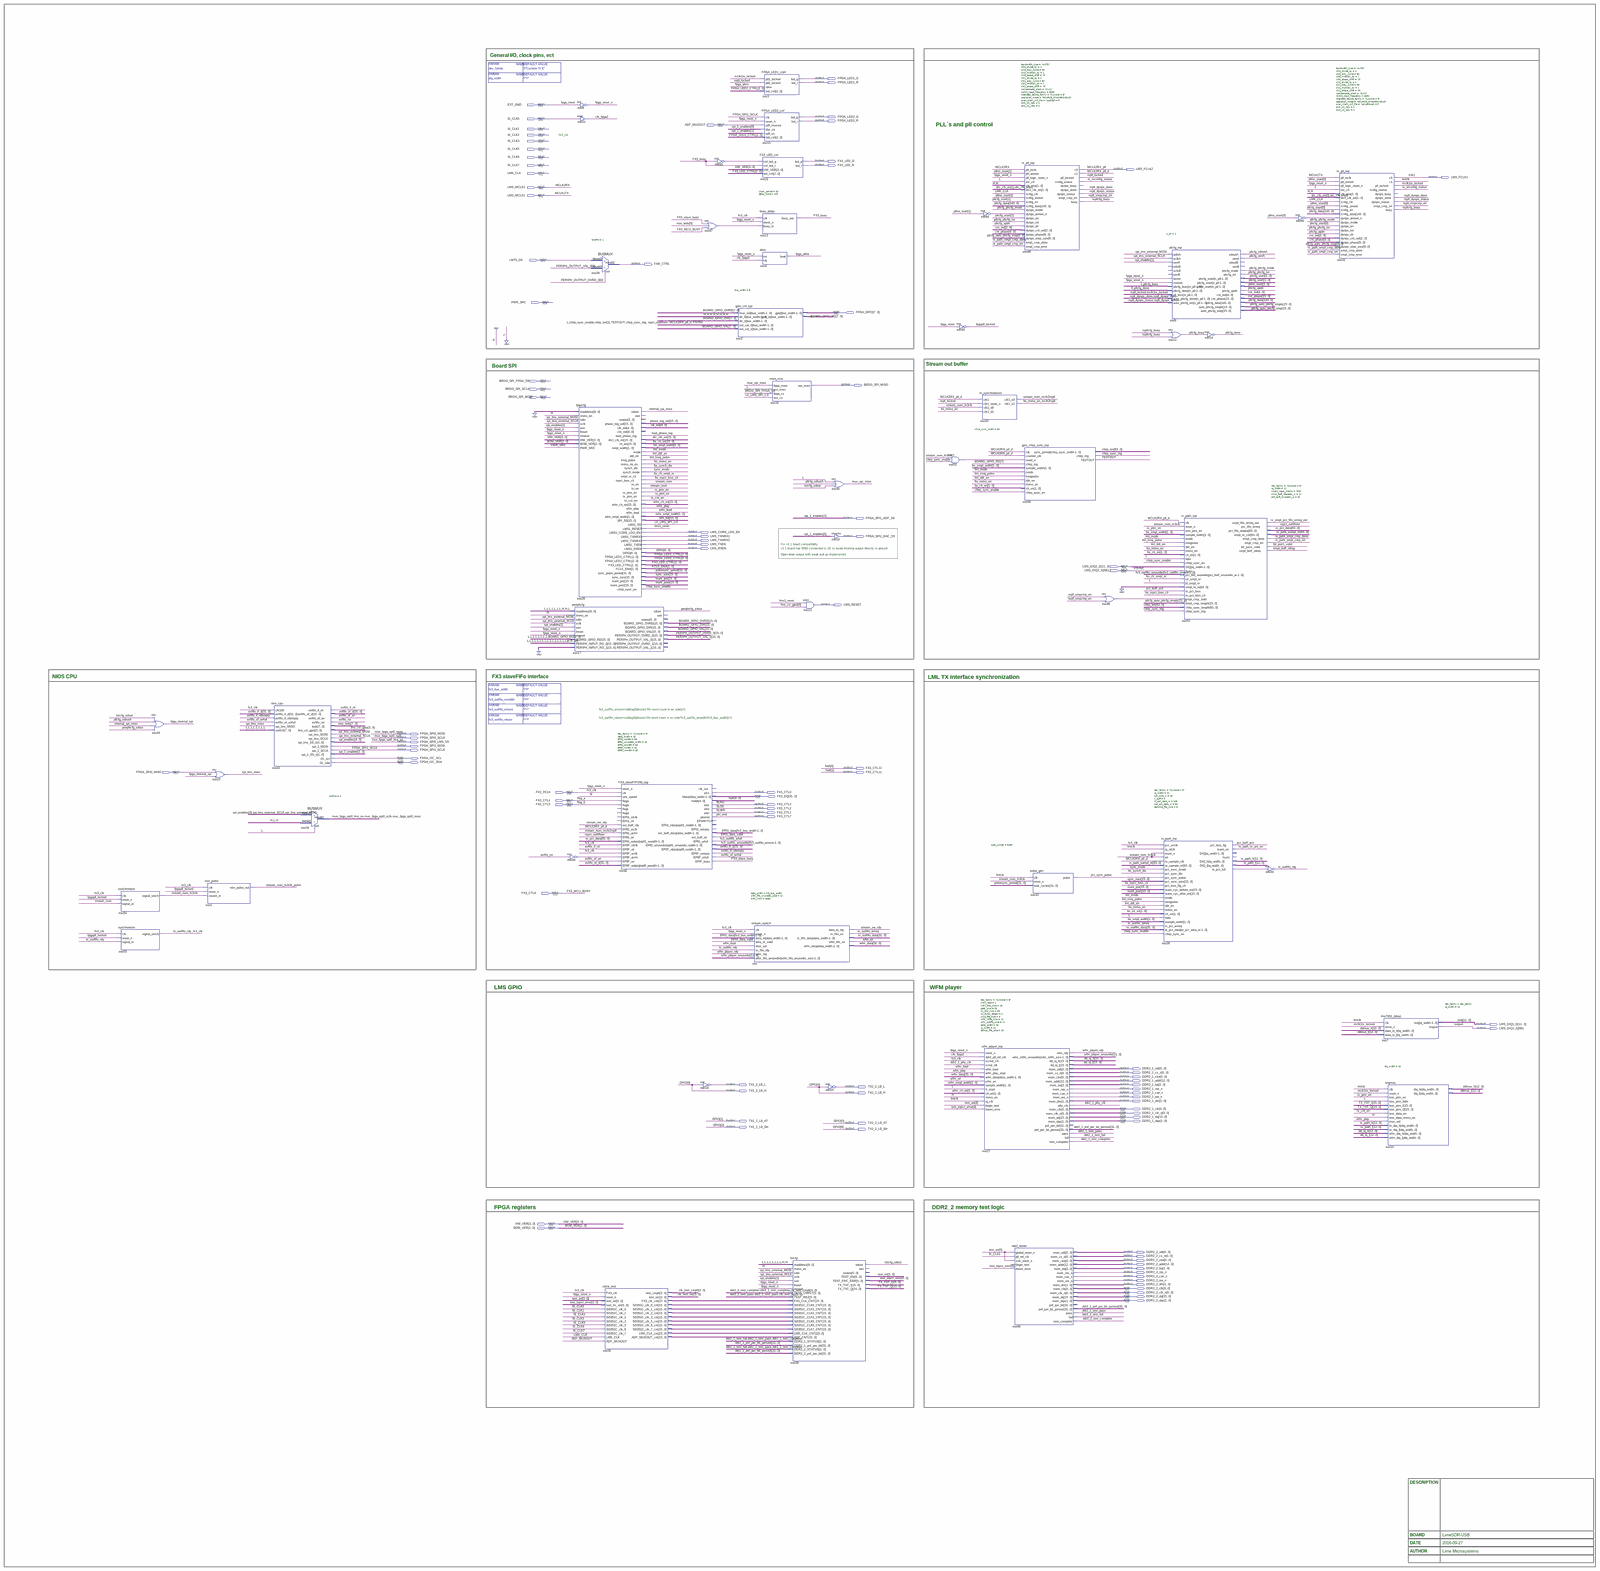
[diagram p0: schematic sheet, whole]
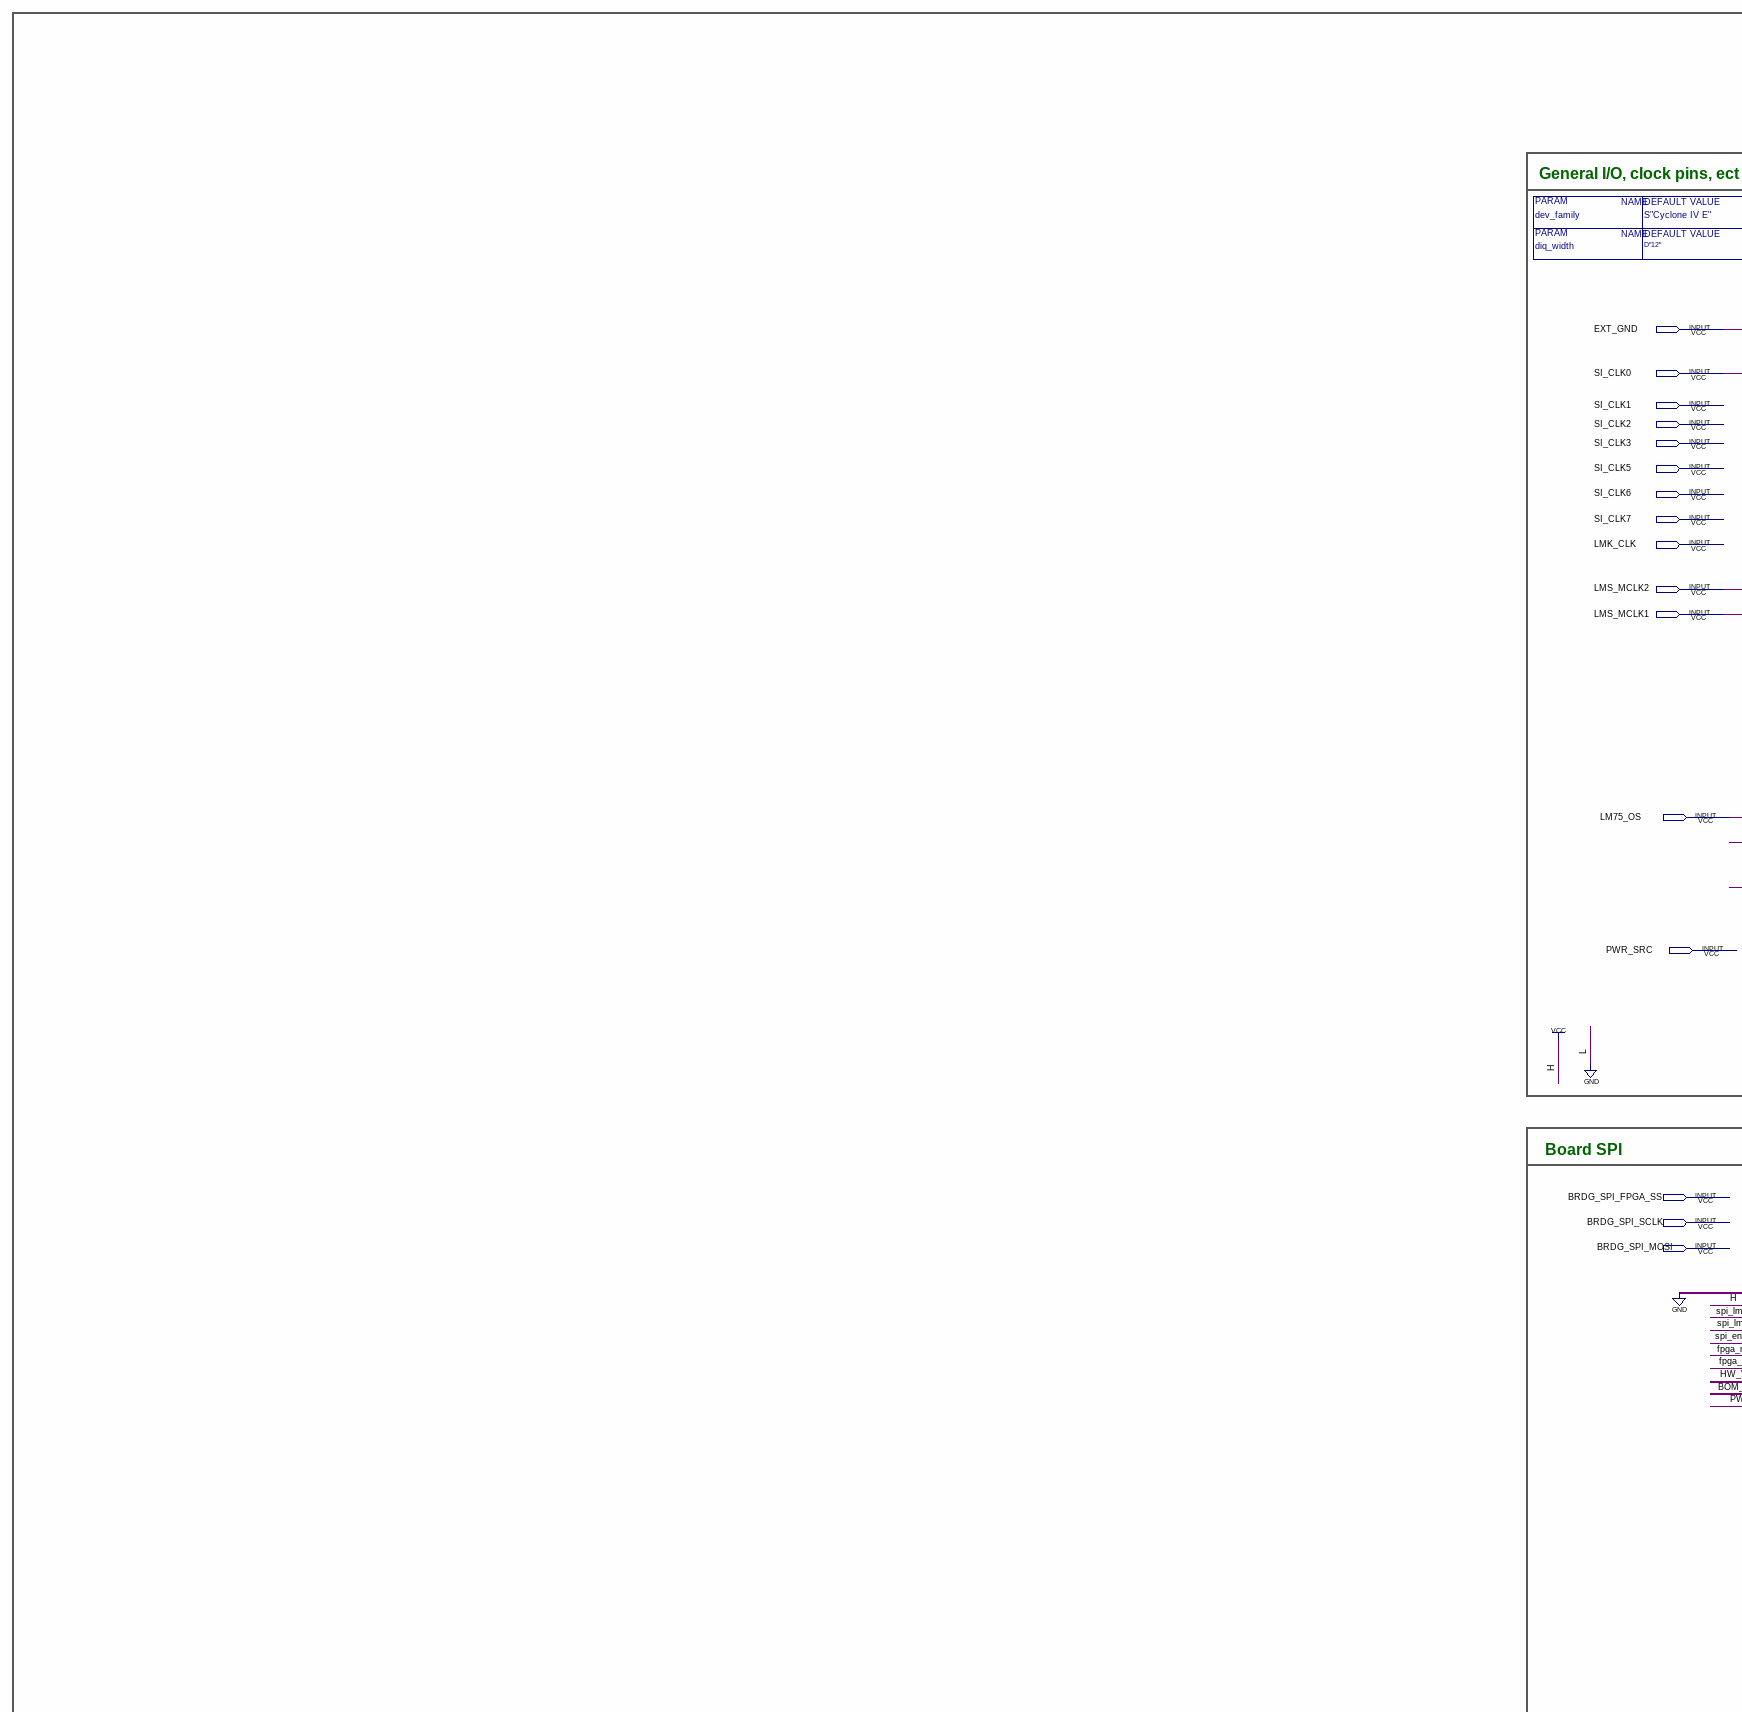
[diagram p1: schematic sheet, upper left part]
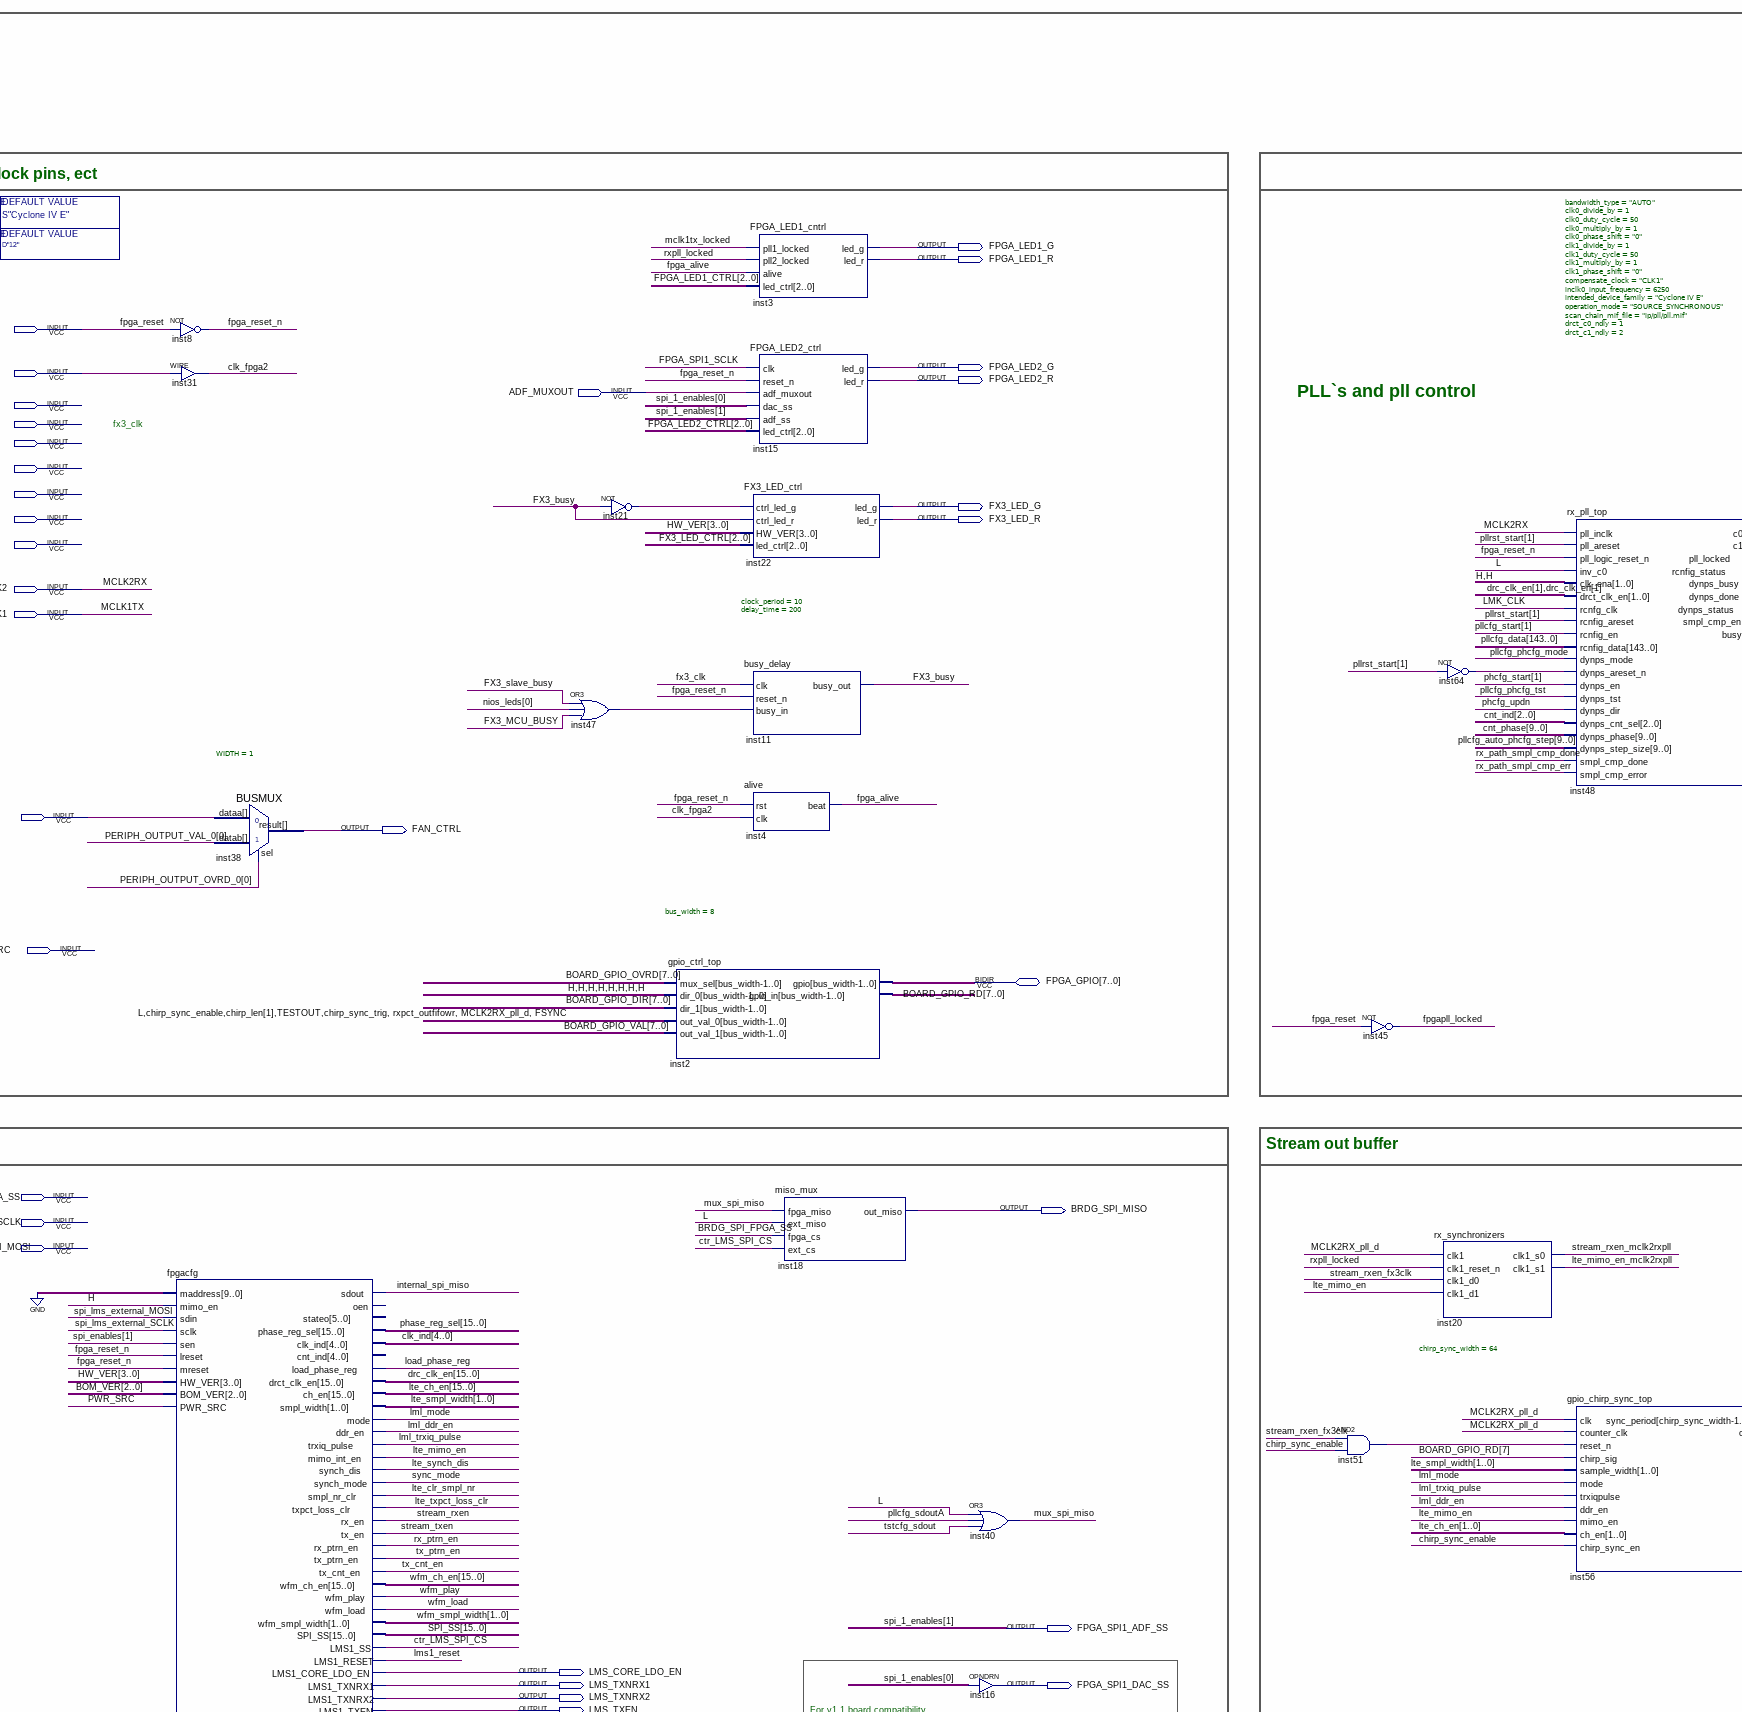
[diagram p2: schematic sheet, upper centre part]
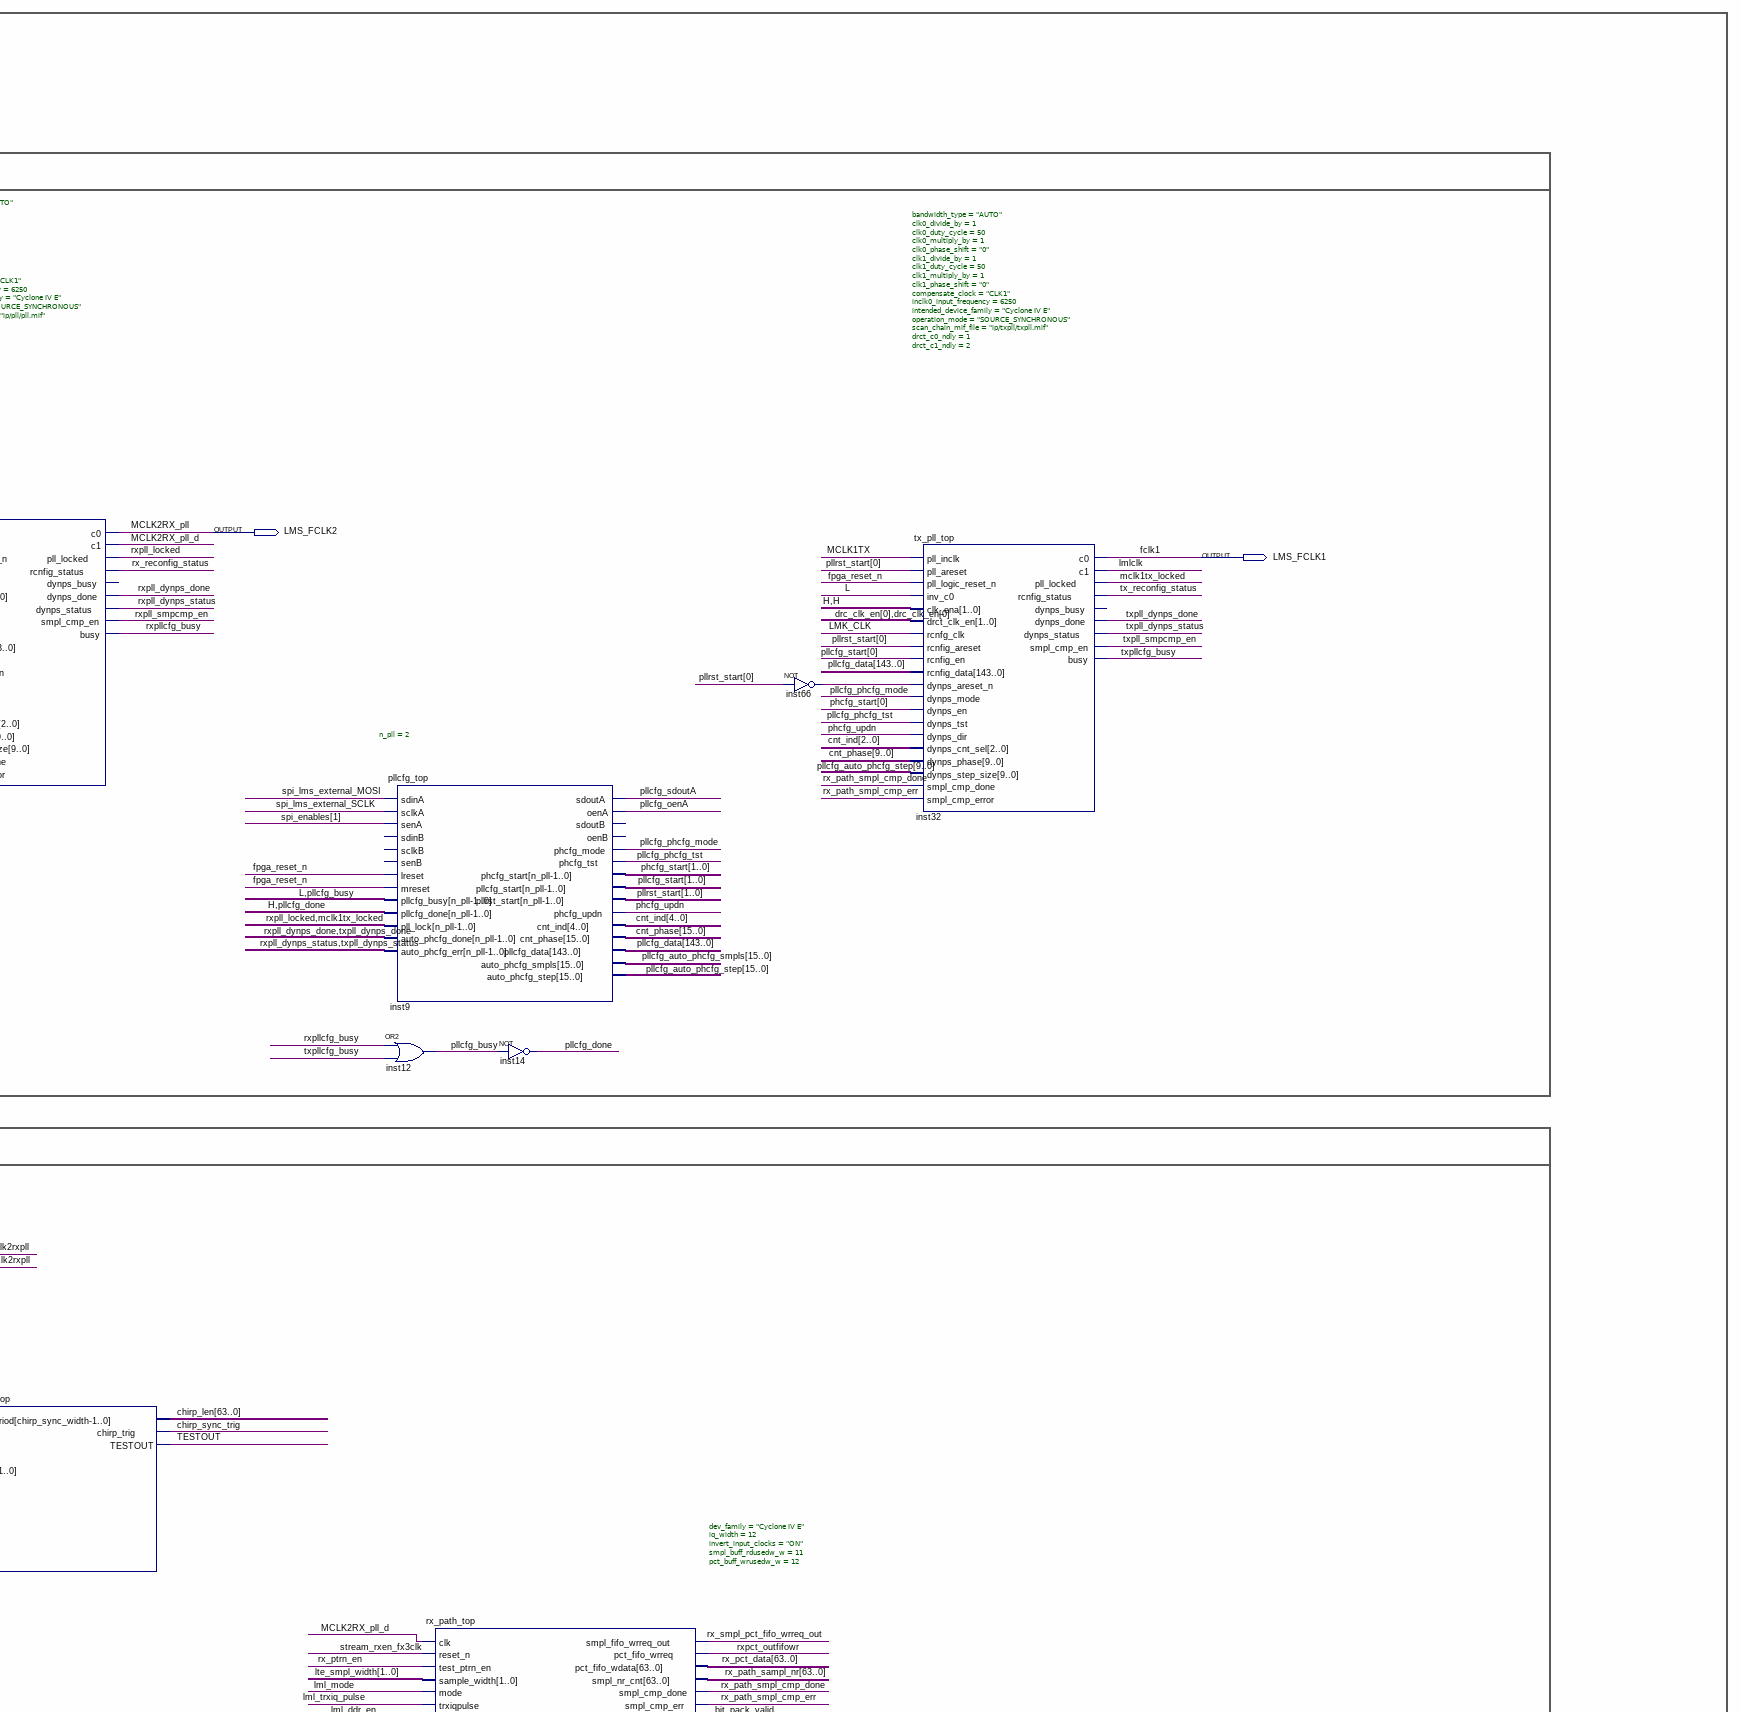
[diagram p3: schematic sheet, upper right part]
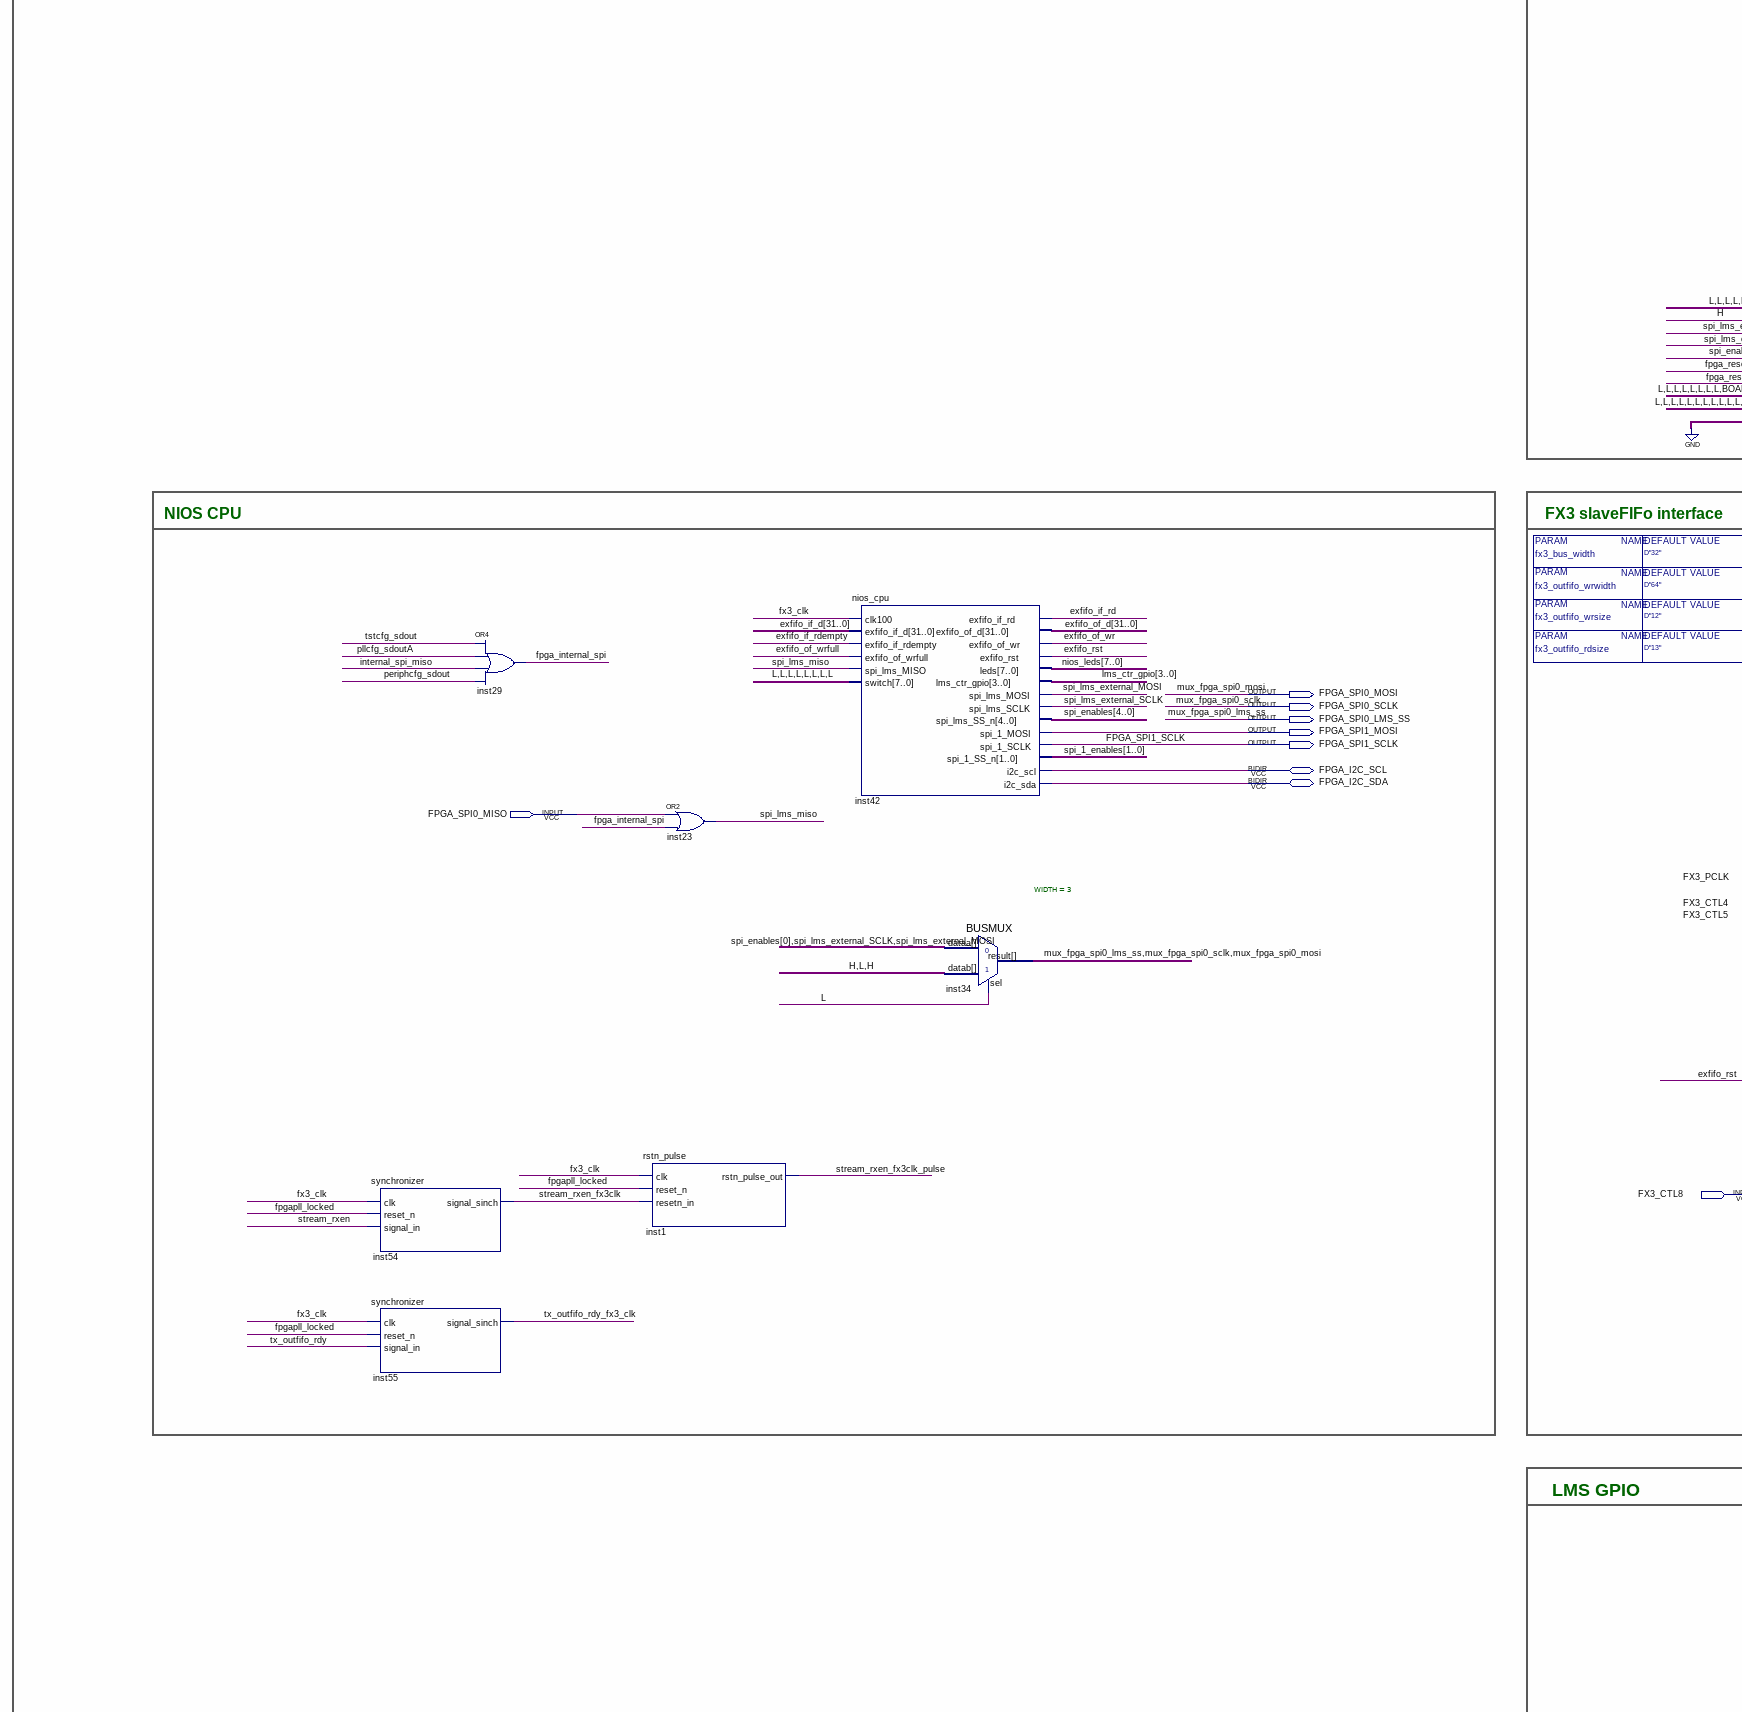
[diagram p4: schematic sheet, middle left part]
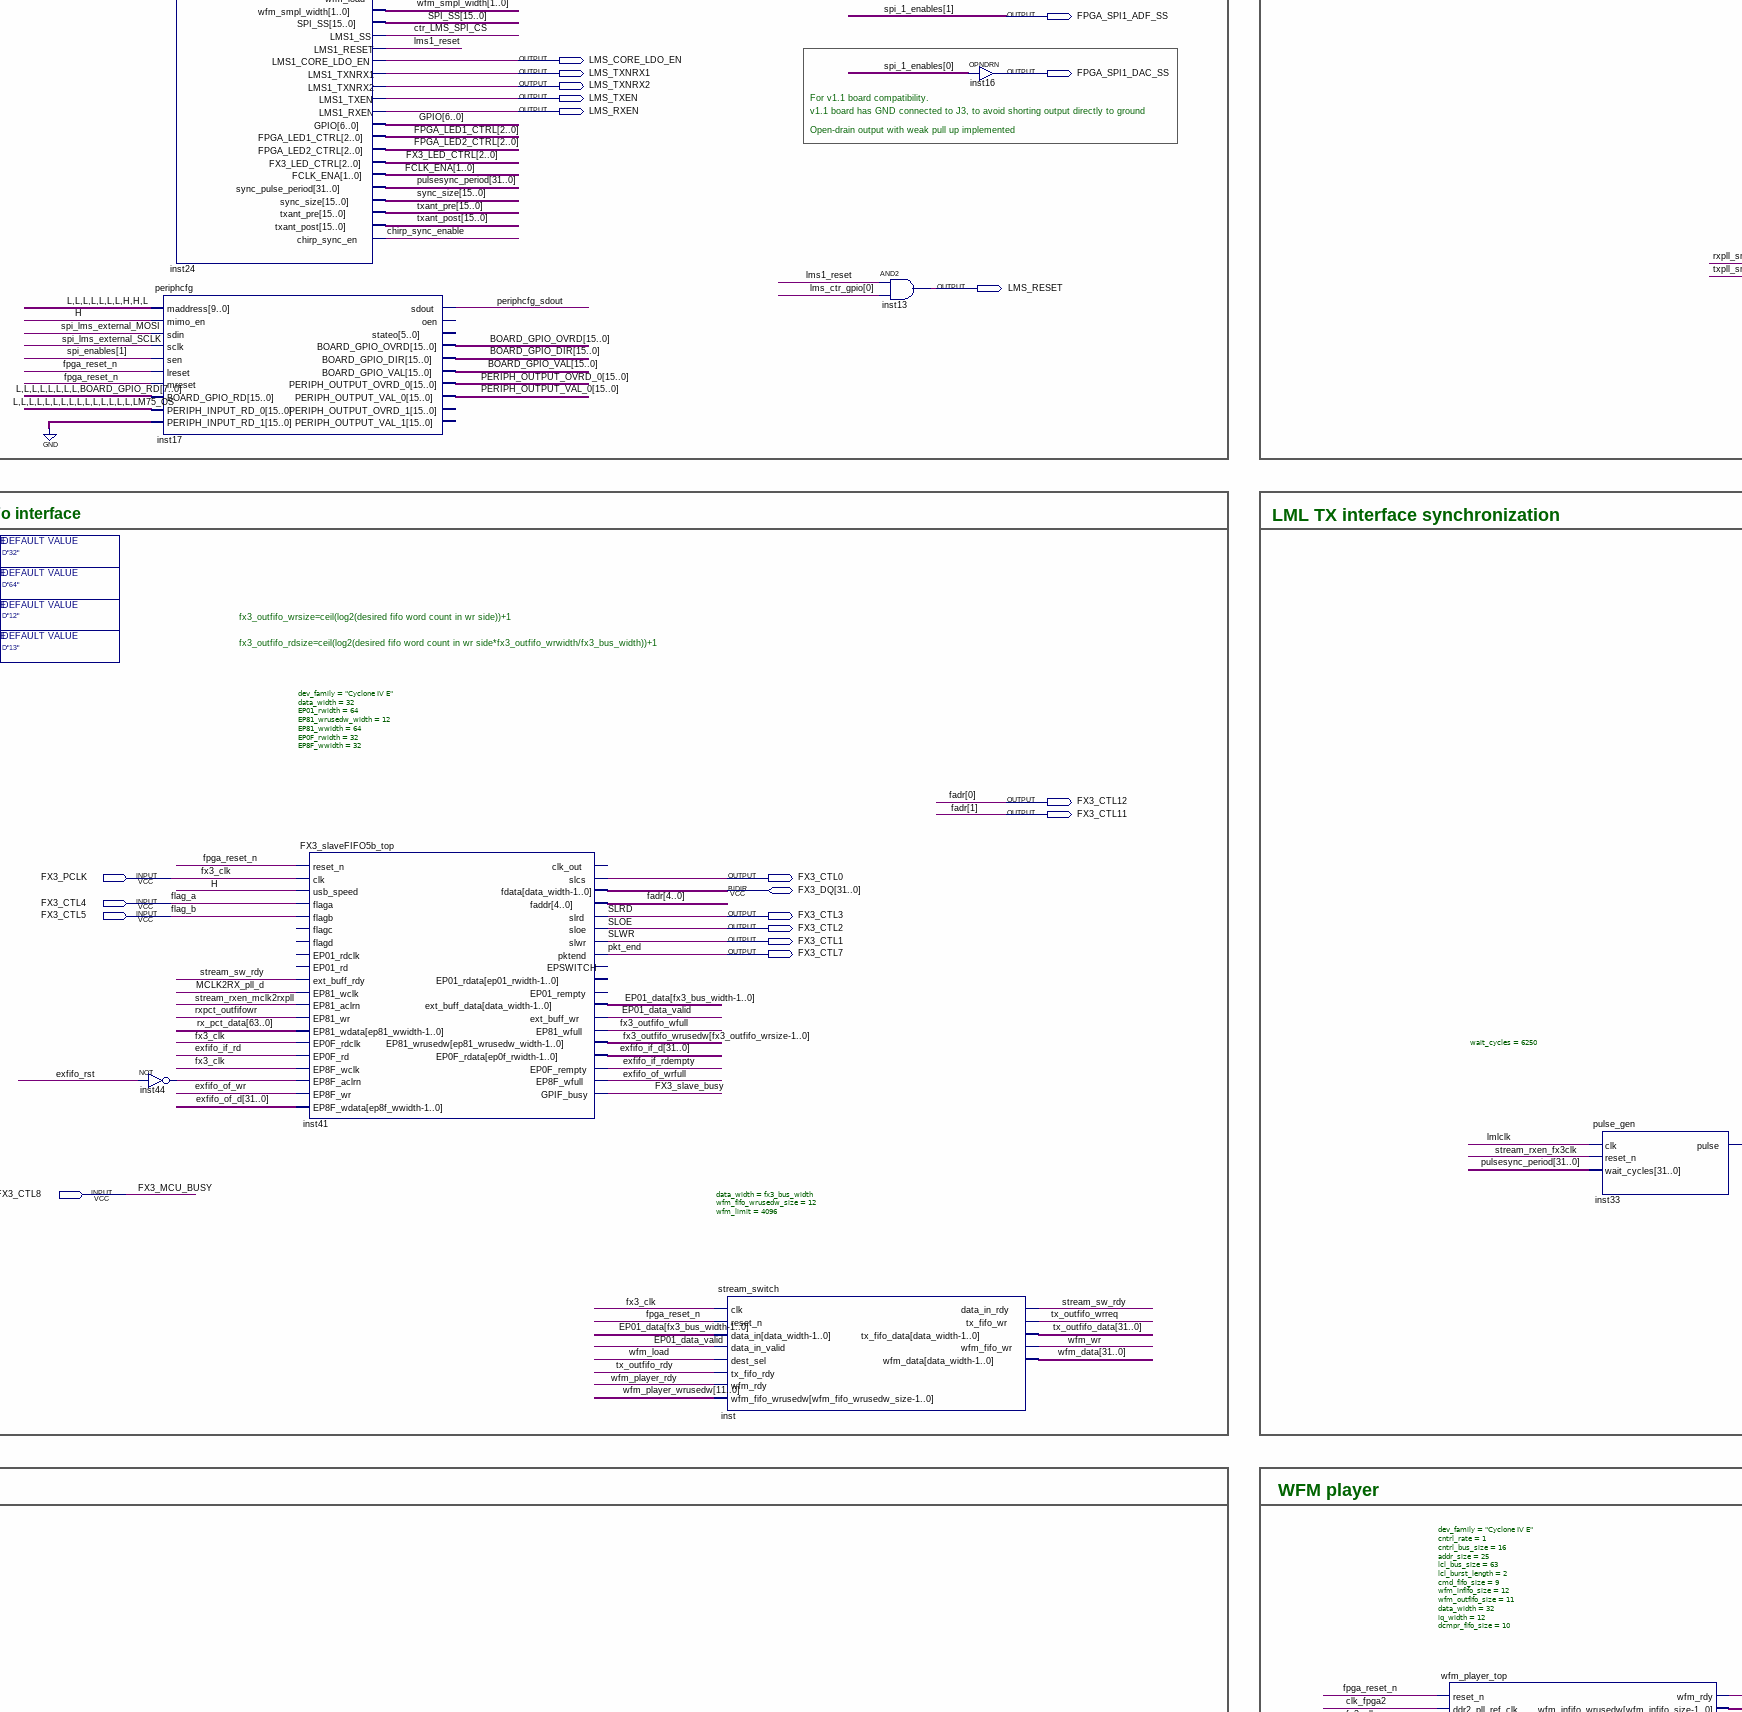
[diagram p5: schematic sheet, middle centre part]
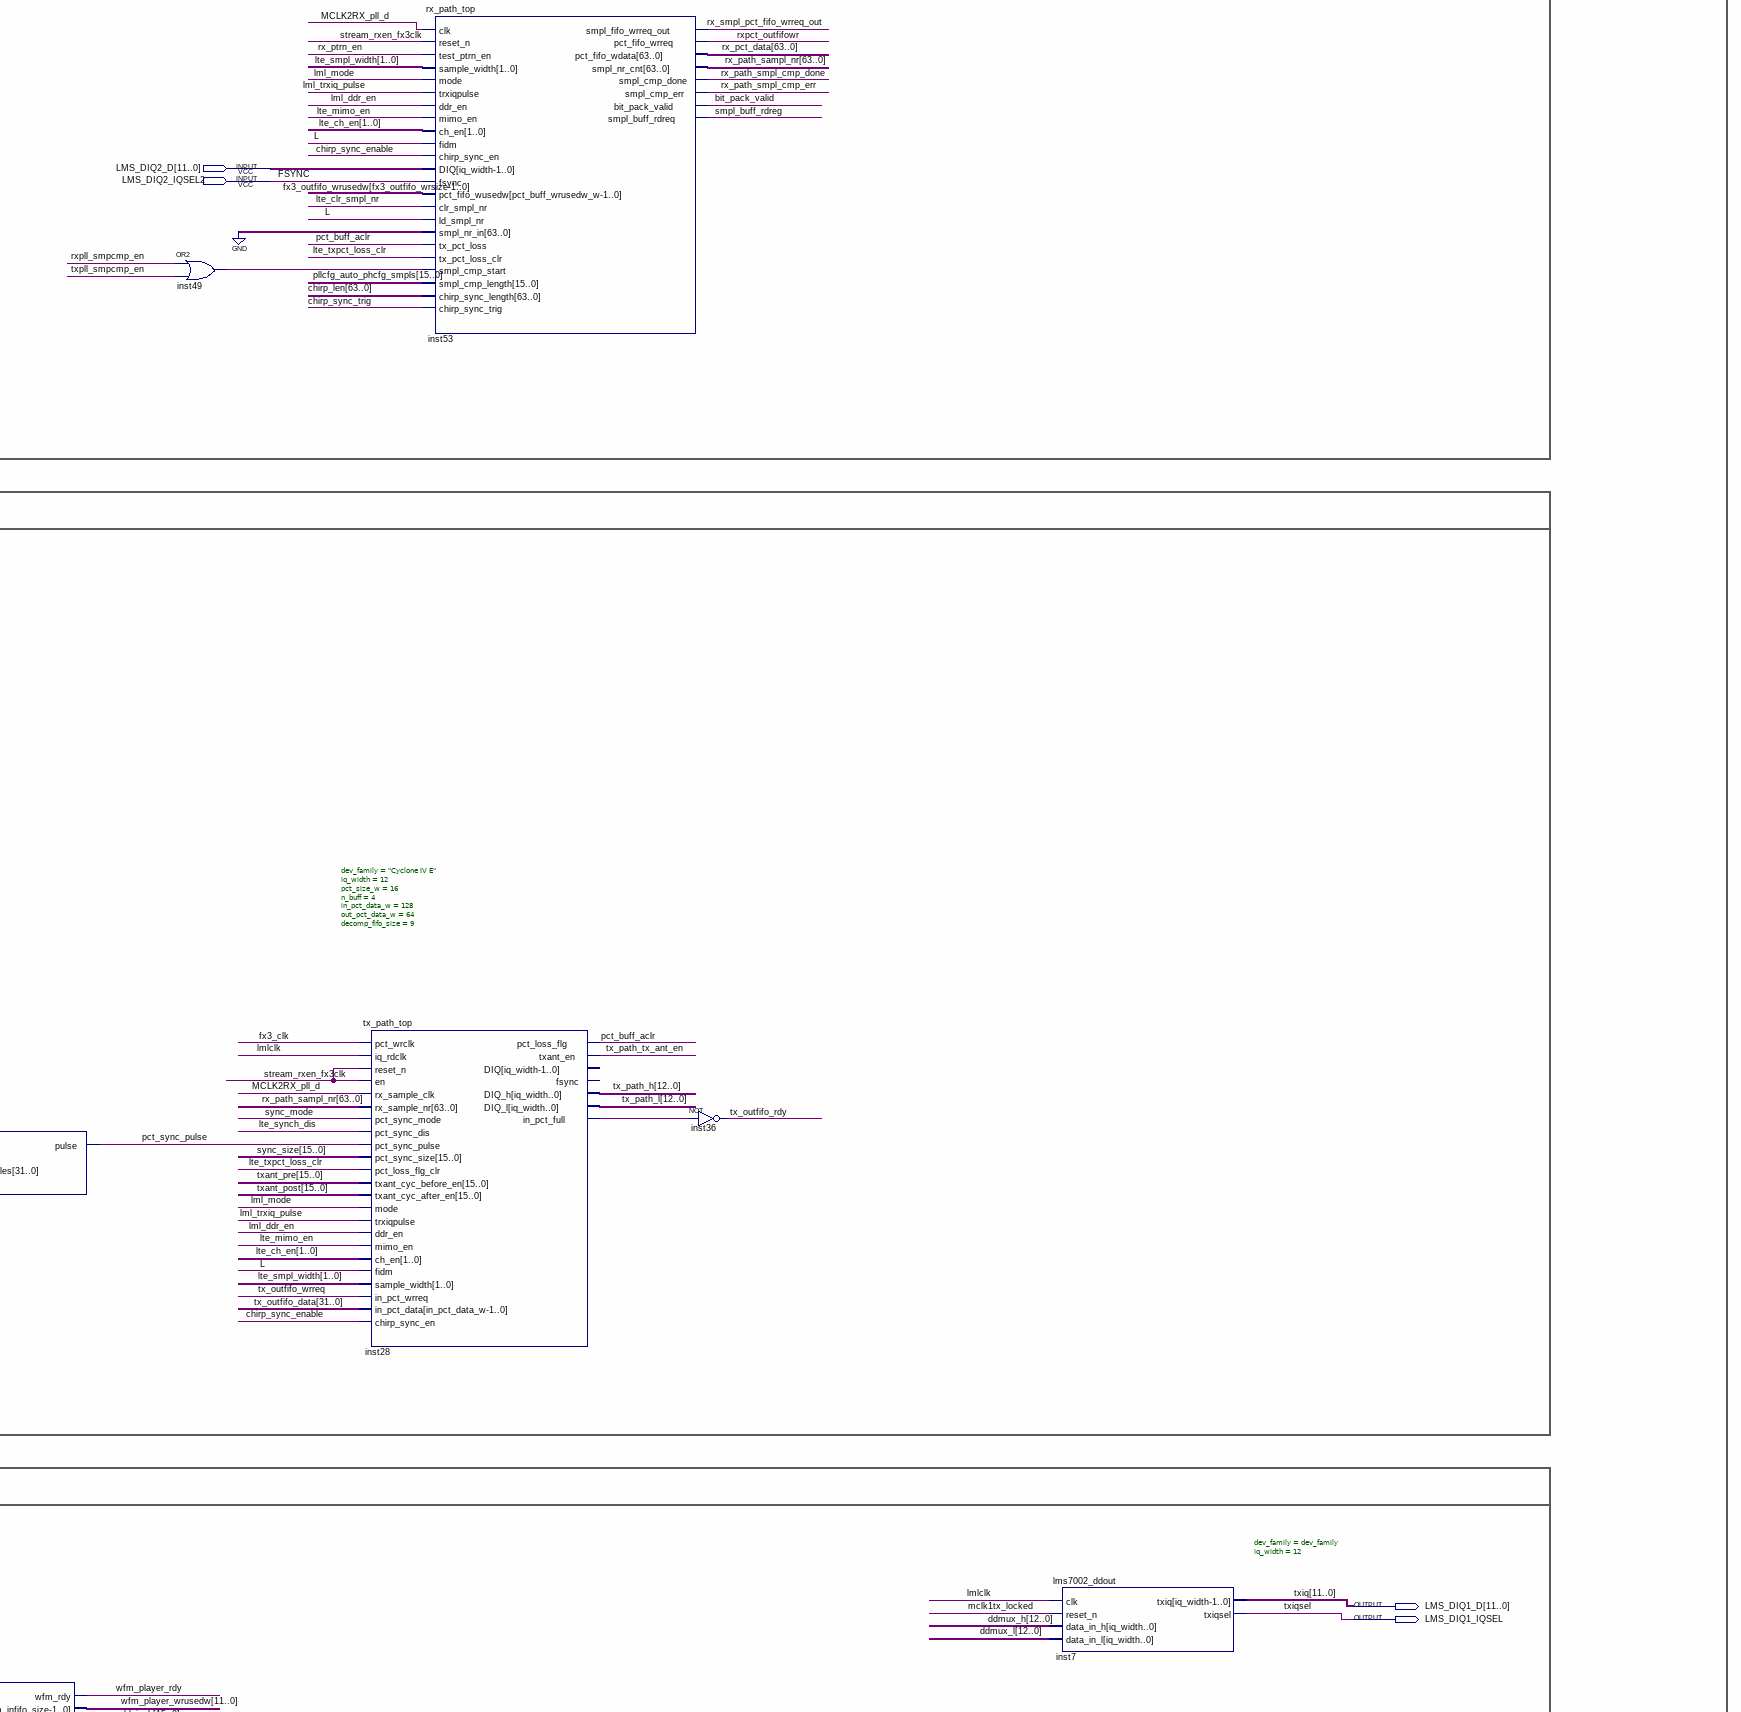
[diagram p6: schematic sheet, middle right part]
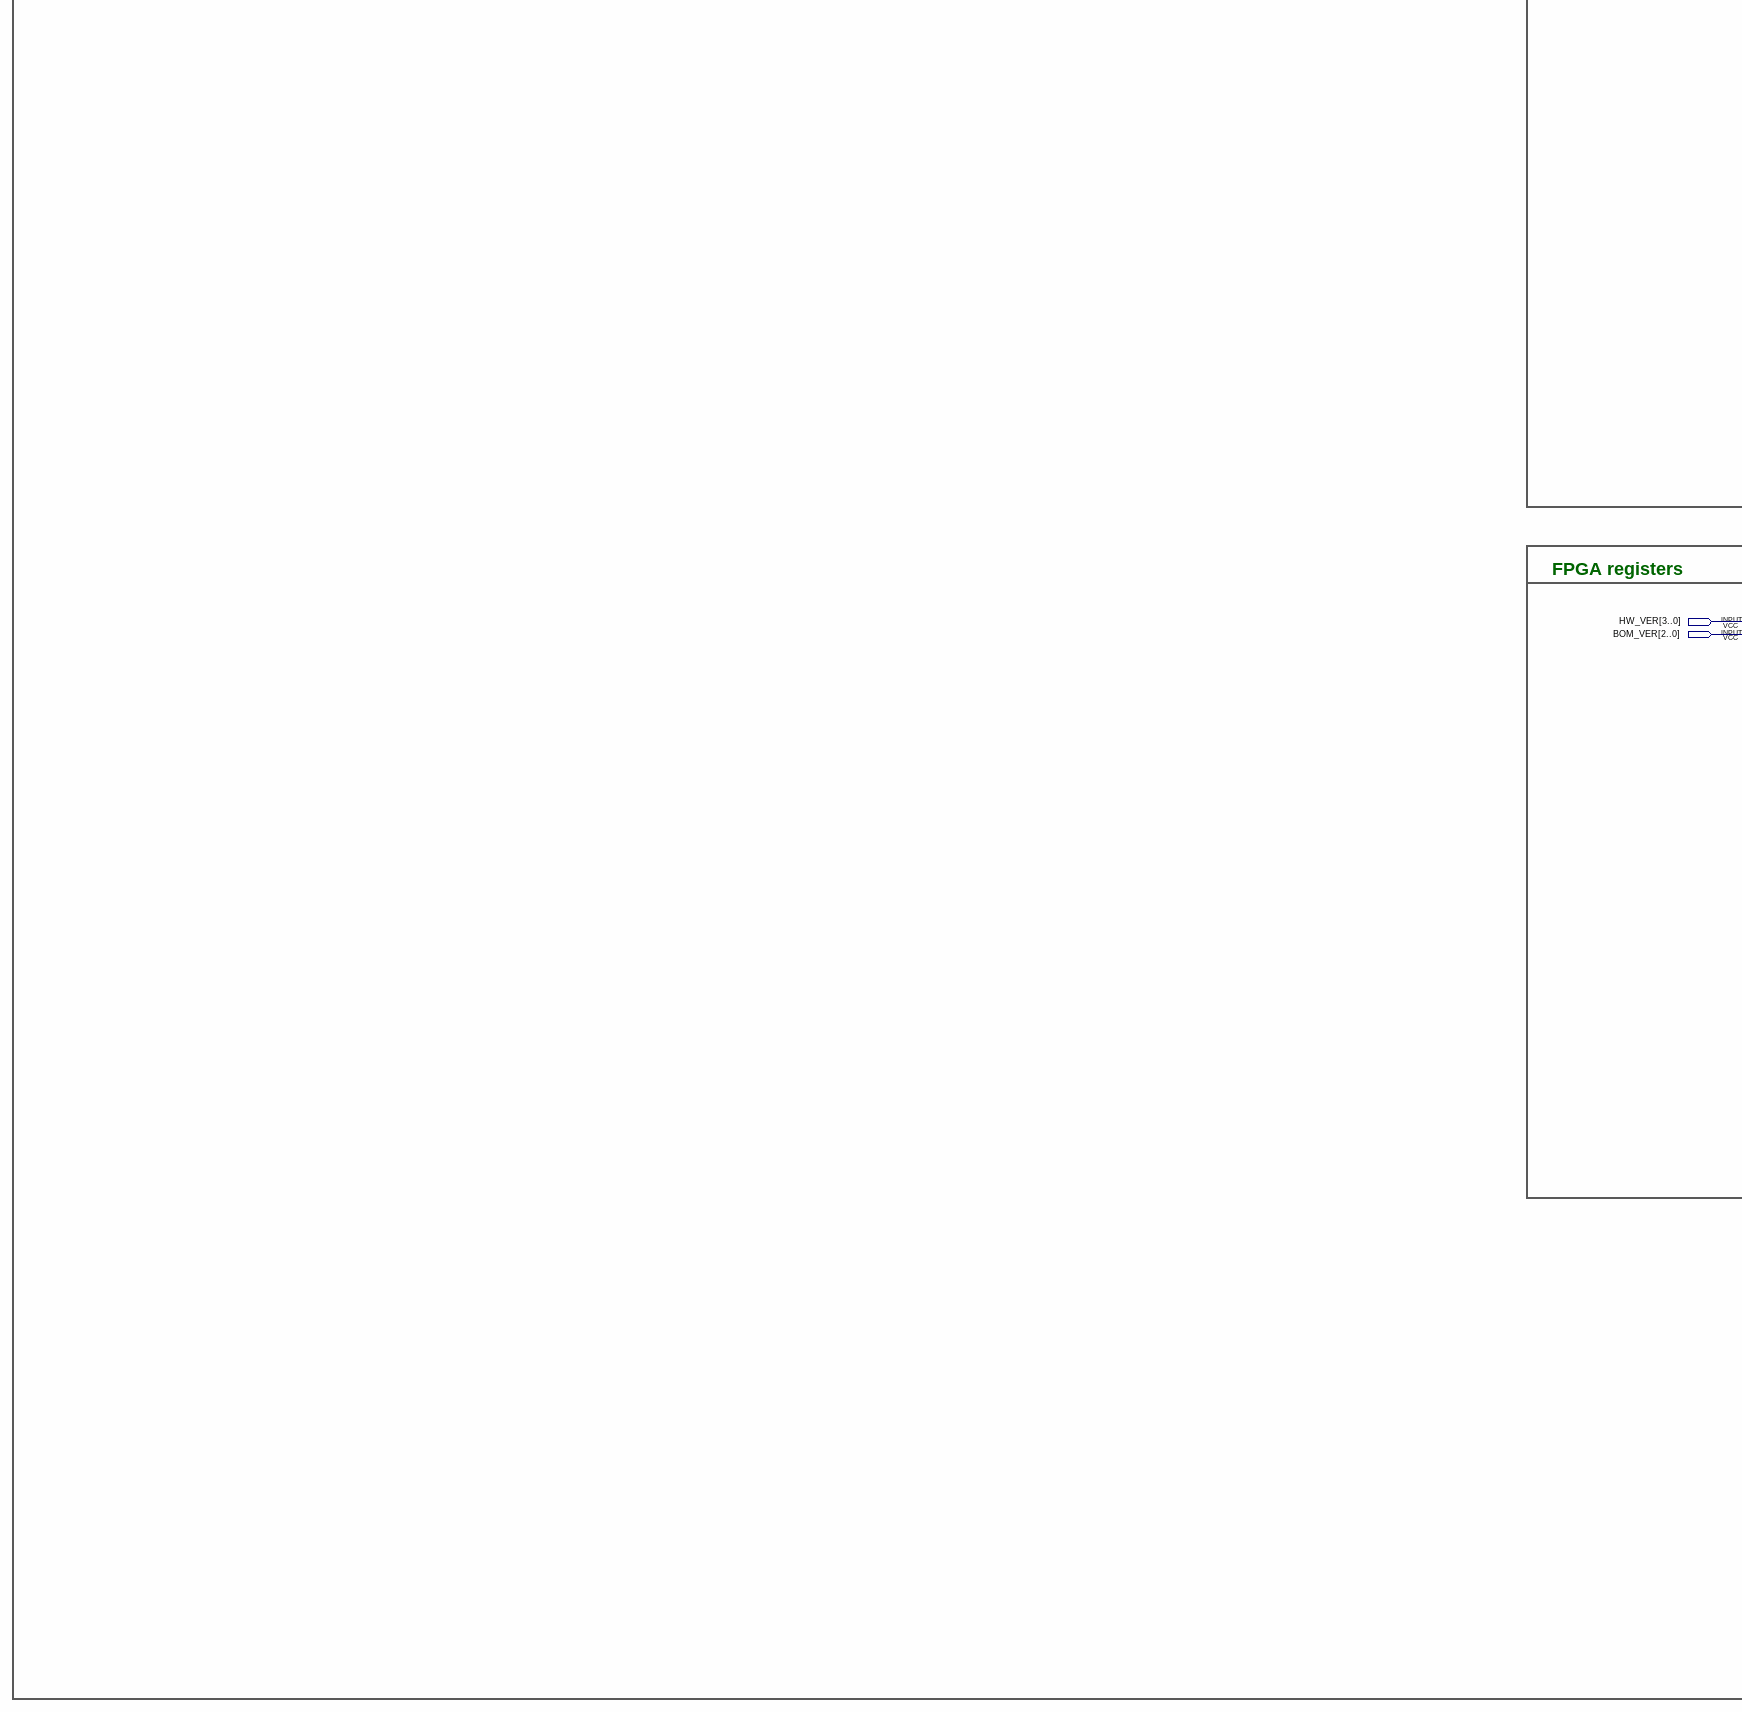
[diagram p7: schematic sheet, lower left part]
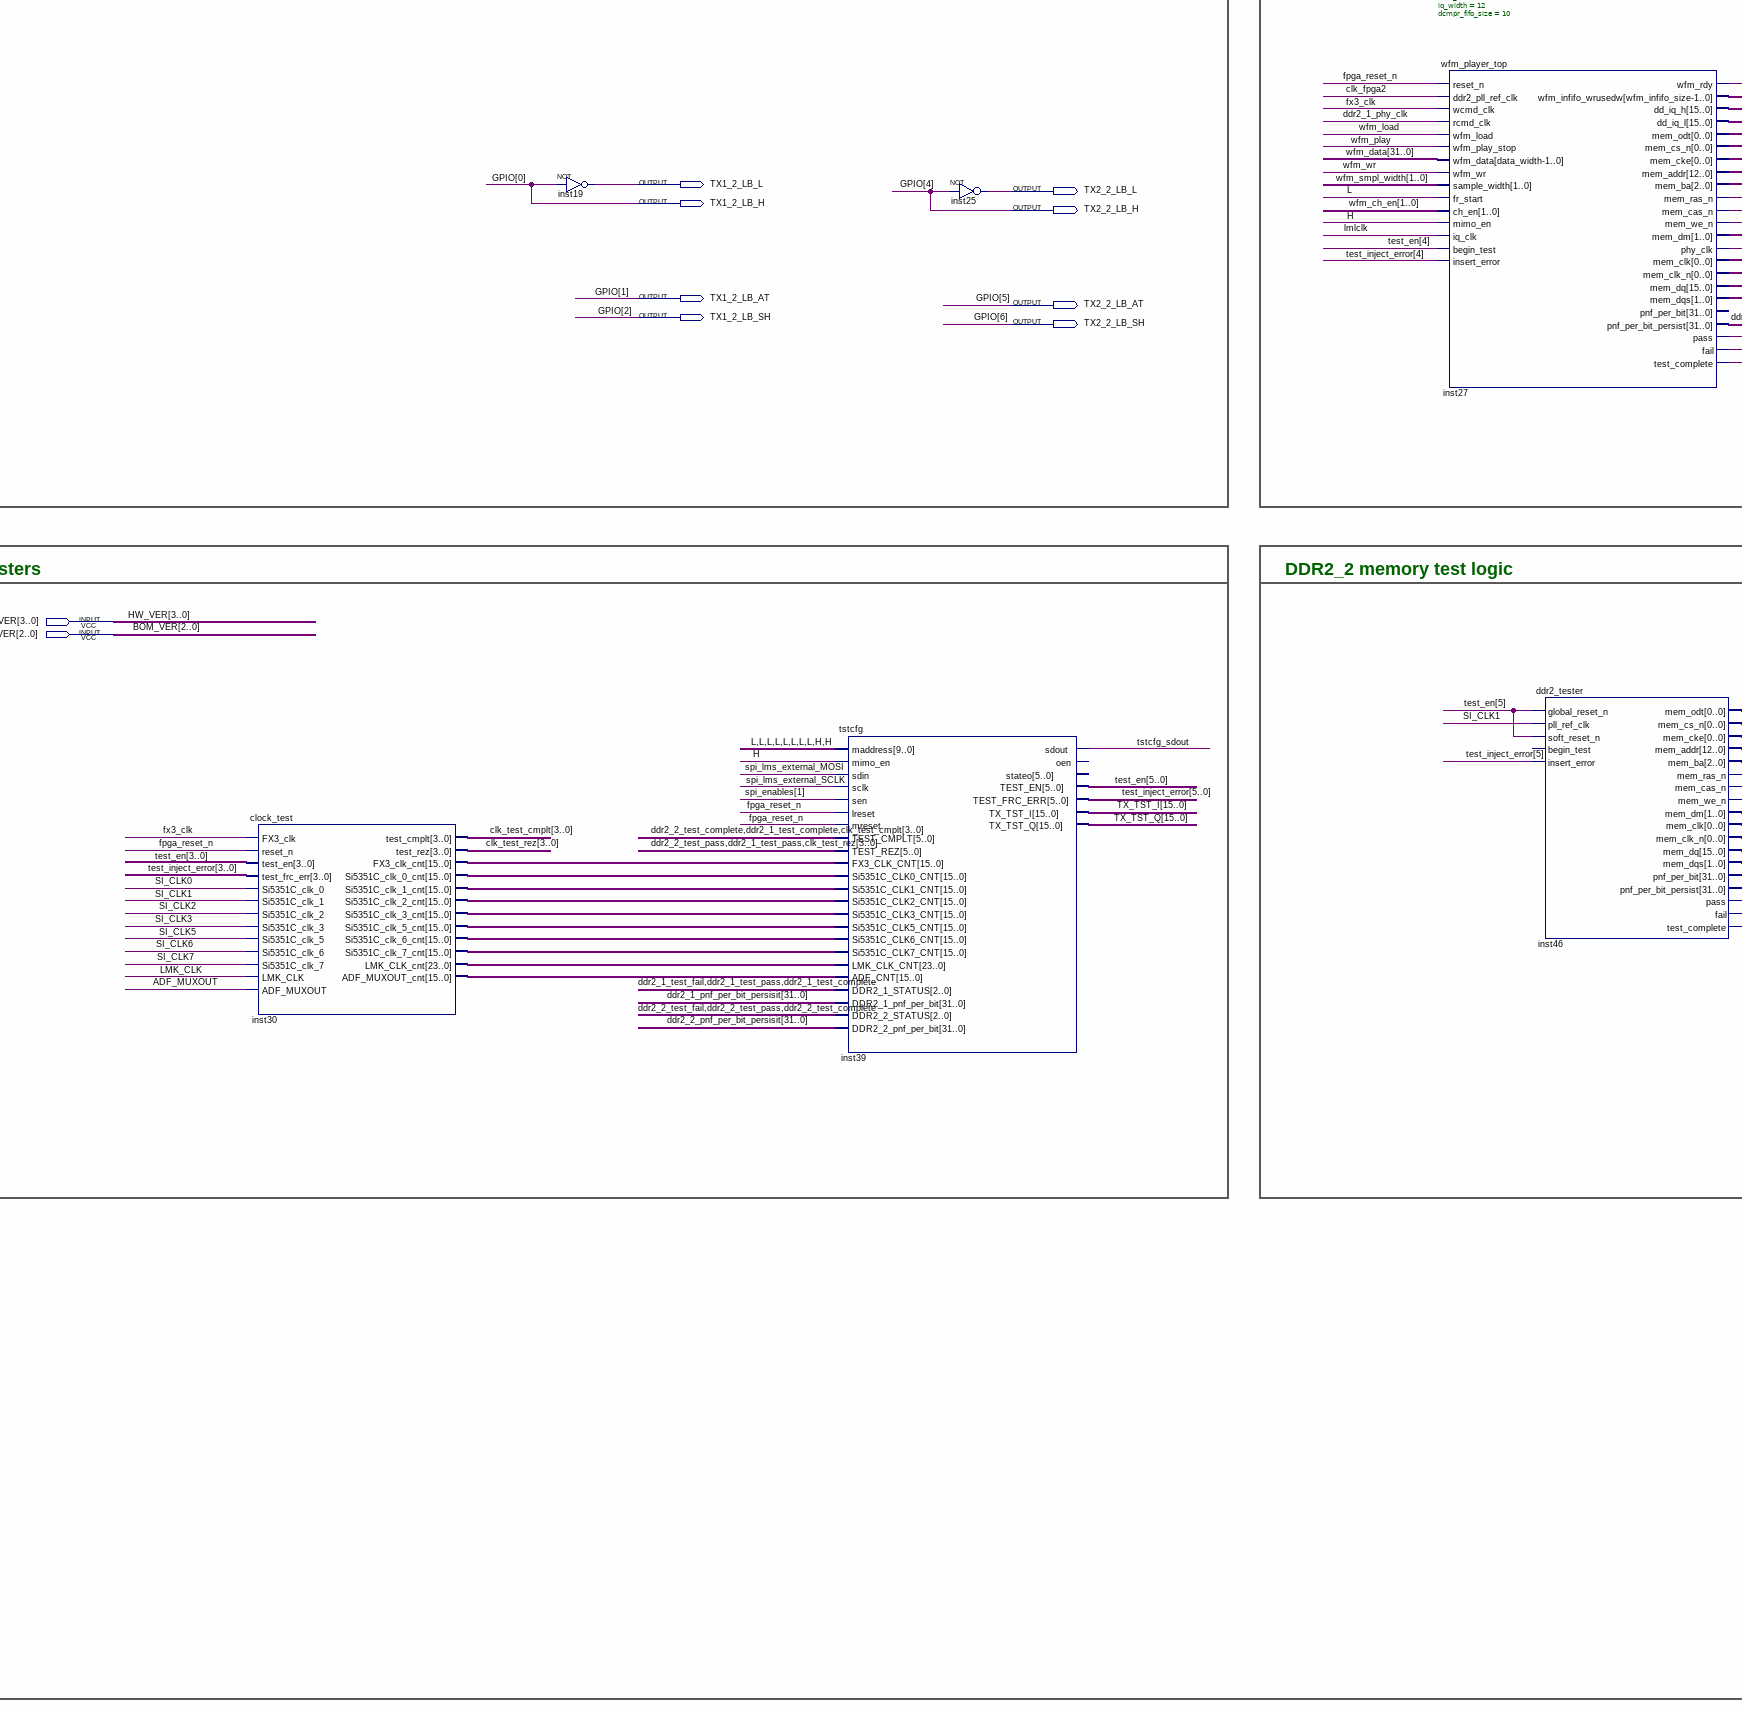
[diagram p8: schematic sheet, lower centre part]
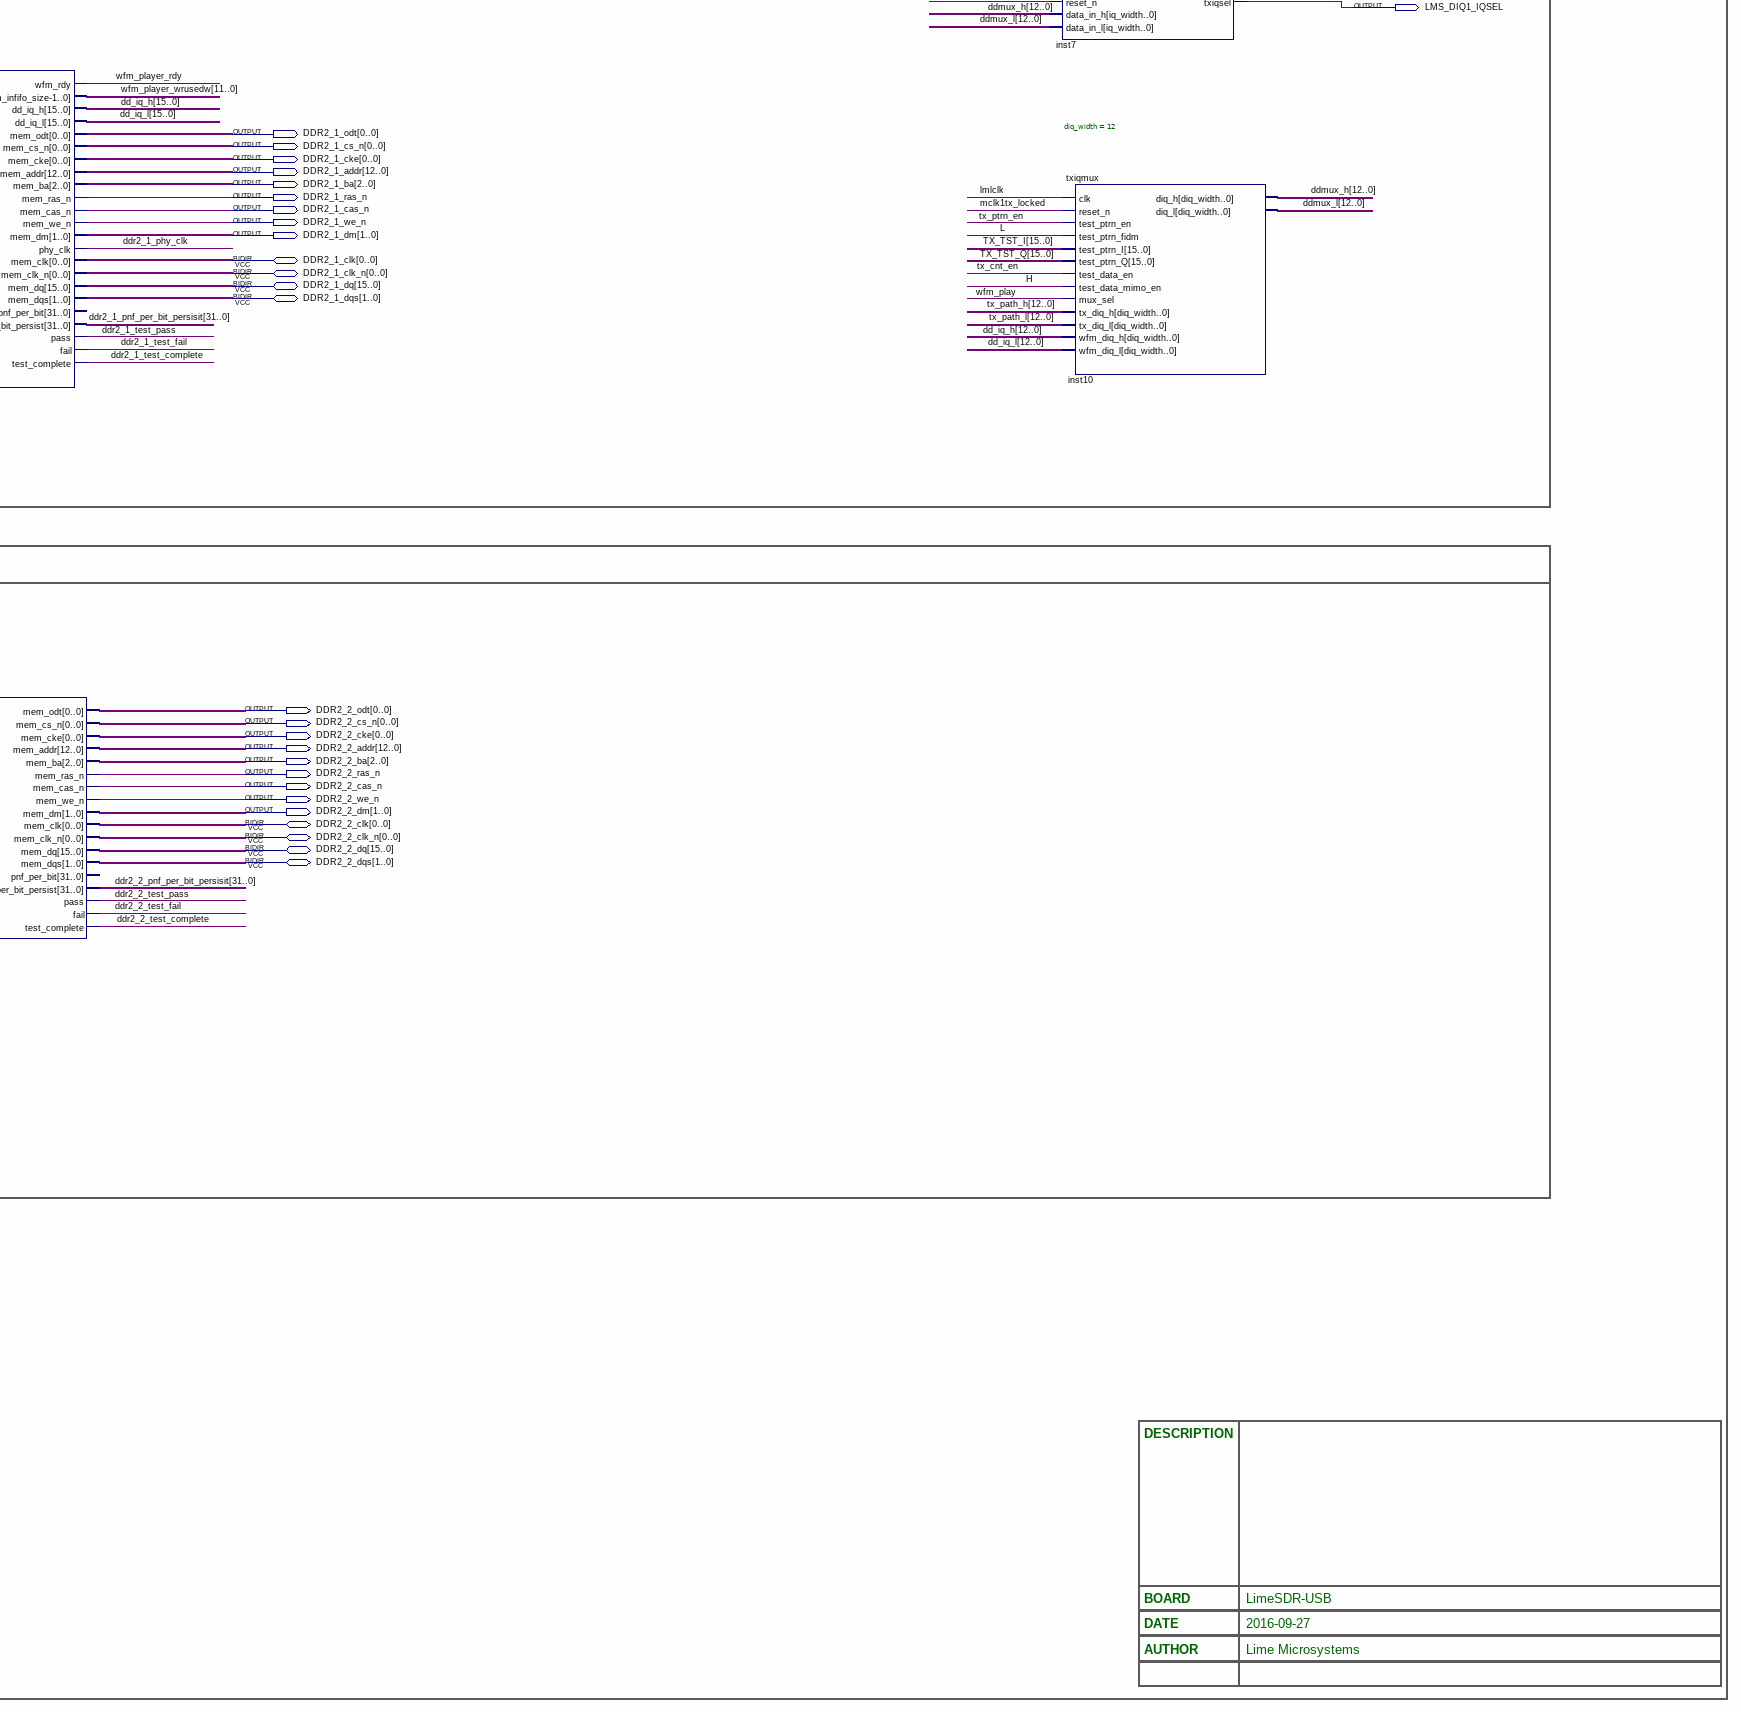
[diagram p9: schematic sheet, lower right part]
// Quartus schematic lms7_trx_top.bdf as structural Verilog: 51 symbols, 96 pins
module lms7_trx_top #(parameter dev_family = "S\"Cyclone IV E\"", parameter diq_width = "D\"12\"", parameter fx3_bus_width = "D\"32\"", parameter fx3_outfifo_wrwidth = "D\"64\"", parameter fx3_outfifo_wrsize = "D\"12\"", parameter fx3_outfifo_rdsize = "D\"13\"") (
  input  EXT_GND,
  input  SI_CLK0,
  input  ADF_MUXOUT,
  input  SI_CLK1,
  input  SI_CLK2,
  input  SI_CLK3,
  input  SI_CLK5,
  input  SI_CLK6,
  input  SI_CLK7,
  input  LMK_CLK,
  input  LMS_MCLK2,
  input  LMS_MCLK1,
  input  LM75_OS,
  input  PWR_SRC,
  input  BRDG_SPI_FPGA_SS,
  input  BRDG_SPI_SCLK,
  input  BRDG_SPI_MOSI,
  input  [11:0] LMS_DIQ2_D,
  input  LMS_DIQ2_IQSEL2,
  input  FPGA_SPI0_MISO,
  input  FX3_PCLK,
  input  FX3_CTL4,
  input  FX3_CTL5,
  input  FX3_CTL8,
  input  [3:0] HW_VER,
  input  [2:0] BOM_VER,
  inout  [7:0] FPGA_GPIO,
  inout  FPGA_I2C_SCL,
  inout  FPGA_I2C_SDA,
  inout  [31:0] FX3_DQ,
  inout  [0:0] DDR2_1_clk,
  inout  [0:0] DDR2_1_clk_n,
  inout  [15:0] DDR2_1_dq,
  inout  [1:0] DDR2_1_dqs,
  inout  [0:0] DDR2_2_clk,
  inout  [0:0] DDR2_2_clk_n,
  inout  [15:0] DDR2_2_dq,
  inout  [1:0] DDR2_2_dqs,
  output FPGA_LED1_G,
  output FPGA_LED1_R,
  output FPGA_LED2_G,
  output FPGA_LED2_R,
  output FX3_LED_G,
  output FX3_LED_R,
  output LMS_FCLK2,
  output LMS_FCLK1,
  output FAN_CTRL,
  output BRDG_SPI_MISO,
  output FPGA_SPI1_ADF_SS,
  output LMS_CORE_LDO_EN,
  output LMS_TXNRX1,
  output FPGA_SPI1_DAC_SS,
  output LMS_TXNRX2,
  output LMS_TXEN,
  output LMS_RXEN,
  output LMS_RESET,
  output FPGA_SPI0_MOSI,
  output FPGA_SPI0_SCLK,
  output FPGA_SPI0_LMS_SS,
  output FPGA_SPI1_MOSI,
  output FPGA_SPI1_SCLK,
  output FX3_CTL12,
  output FX3_CTL11,
  output FX3_CTL0,
  output FX3_CTL3,
  output FX3_CTL2,
  output FX3_CTL1,
  output FX3_CTL7,
  output [11:0] LMS_DIQ1_D,
  output LMS_DIQ1_IQSEL,
  output [0:0] DDR2_1_odt,
  output [0:0] DDR2_1_cs_n,
  output [0:0] DDR2_1_cke,
  output [12:0] DDR2_1_addr,
  output TX1_2_LB_L,
  output [2:0] DDR2_1_ba,
  output TX2_2_LB_L,
  output DDR2_1_ras_n,
  output TX1_2_LB_H,
  output TX2_2_LB_H,
  output DDR2_1_cas_n,
  output DDR2_1_we_n,
  output [1:0] DDR2_1_dm,
  output TX1_2_LB_AT,
  output TX2_2_LB_AT,
  output TX1_2_LB_SH,
  output TX2_2_LB_SH,
  output [0:0] DDR2_2_odt,
  output [0:0] DDR2_2_cs_n,
  output [0:0] DDR2_2_cke,
  output [12:0] DDR2_2_addr,
  output [2:0] DDR2_2_ba,
  output DDR2_2_ras_n,
  output DDR2_2_cas_n,
  output DDR2_2_we_n,
  output [1:0] DDR2_2_dm
);

  wire bit_pack_valid, chirp_sync_enable, chirp_sync_trig, clk_fpga2, ctr_LMS_SPI_CS, ddr2_1_phy_clk,
       ddr2_1_test_complete, ddr2_1_test_fail, ddr2_1_test_pass, ddr2_2_test_complete, ddr2_2_test_fail,
       ddr2_2_test_pass, \EP01_data[fx3_bus_width-1..0] , EP01_data_valid, exfifo_if_rd, exfifo_if_rdempty,
       exfifo_of_wr, exfifo_of_wrfull, exfifo_rst, fpga_alive, fpga_internal_spi, fpga_reset_n,
       fpgapll_locked, FX3_busy, fx3_outfifo_wfull, \fx3_outfifo_wrusedw[fx3_outfifo_wrsize-1..0] ,
       FX3_slave_busy, inst21_out, inst28_in_pct_full, inst44_out, inst47_out, inst49_out, inst51_out,
       inst64_out, inst66_out, internal_spi_miso, lml_ddr_en, lml_mode, lml_trxiq_pulse, lmlclk, lms1_reset,
       load_phase_reg, lte_clr_smpl_nr, lte_mimo_en, lte_mimo_en_mclk2rxpll, lte_synch_dis,
       lte_txpct_loss_clr, mclk1tx_locked, MCLK2RX_pll_d, mux_spi_miso, pct_buff_aclr, pct_sync_pulse,
       periphcfg_sdout, phcfg_updn, pllcfg_busy, pllcfg_done, pllcfg_oenA, pllcfg_phcfg_mode,
       pllcfg_phcfg_tst, pllcfg_sdoutA, rx_path_smpl_cmp_done, rx_path_smpl_cmp_err, rx_ptrn_en,
       rx_reconfig_status, rx_smpl_pct_fifo_wrreq_out, rxpct_outfifowr, rxpll_dynps_done, rxpll_dynps_status,
       rxpll_locked, rxpll_smpcmp_en, rxpllcfg_busy, smpl_buff_rdreg, spi_lms_external_MOSI,
       spi_lms_external_SCLK, spi_lms_miso, stream_rxen, stream_rxen_fx3clk, stream_rxen_fx3clk_pulse,
       stream_rxen_mclk2rxpll, stream_sw_rdy, stream_txen, sync_mode, TESTOUT, tstcfg_sdout, tx_cnt_en,
       tx_outfifo_rdy, tx_outfifo_rdy_fx3_clk, tx_outfifo_wrreq, tx_path_tx_ant_en, tx_ptrn_en,
       tx_reconfig_status, txpll_dynps_done, txpll_dynps_status, txpll_smpcmp_en, txpllcfg_busy, wfm_load,
       wfm_play, wfm_player_rdy, wfm_wr;
  wire [0:0] spi_1_enables;
  wire [1:0] FCLK_ENA, lte_smpl_width, phcfg_start, pllcfg_start, pllrst_start, wfm_smpl_width;
  wire [2:0] FPGA_LED1_CTRL, FPGA_LED2_CTRL, FX3_LED_CTRL;
  wire [3:0] clk_test_cmplt, clk_test_rez, lms_ctr_gpio;
  wire [3:3] GPIO;
  wire [4:0] clk_ind, cnt_ind, spi_enables;
  wire [4:2] fadr;
  wire [5:0] test_en, test_inject_error;
  wire [7:0] BOARD_GPIO_RD, nios_leds;
  wire [11:0] wfm_player_wrusedw;
  wire [12:0] ddmux_h, ddmux_l, tx_path_h, tx_path_l;
  wire [15:0] BOARD_GPIO_DIR, BOARD_GPIO_OVRD, BOARD_GPIO_VAL, cnt_phase, dd_iq_h, dd_iq_l, drc_clk_en,
       inst30_adf_muxout_cnt, inst30_fx3_clk_cnt, inst30_si5351c_clk_0_cnt, inst30_si5351c_clk_1_cnt,
       inst30_si5351c_clk_2_cnt, inst30_si5351c_clk_3_cnt, inst30_si5351c_clk_5_cnt,
       inst30_si5351c_clk_6_cnt, inst30_si5351c_clk_7_cnt, lte_ch_en, PERIPH_OUTPUT_OVRD_0,
       PERIPH_OUTPUT_VAL_0, phase_reg_sel, pllcfg_auto_phcfg_smpls, pllcfg_auto_phcfg_step, SPI_SS,
       sync_size, TX_TST_I, TX_TST_Q, txant_post, txant_pre, wfm_ch_en;
  wire [23:0] inst30_lmk_clk_cnt;
  wire [31:0] ddr2_1_pnf_per_bit_persisit, ddr2_2_pnf_per_bit_persisit, exfifo_if_d, exfifo_of_d,
       pulsesync_period, tx_outfifo_data, wfm_data;
  wire [63:0] chirp_len, rx_path_sampl_nr, rx_pct_data;
  wire [143:0] pllcfg_data;

  synchronizer inst54 (
    .clk(FX3_PCLK), .reset_n(fpgapll_locked), .signal_in(stream_rxen), .signal_sinch(stream_rxen_fx3clk));
  synchronizer inst55 (
    .clk(FX3_PCLK), .reset_n(fpgapll_locked), .signal_in(tx_outfifo_rdy),
    .signal_sinch(tx_outfifo_rdy_fx3_clk));
  or inst29 (fpga_internal_spi, tstcfg_sdout, pllcfg_sdoutA, internal_spi_miso, periphcfg_sdout);
  rstn_pulse inst1 (
    .clk(FX3_PCLK), .reset_n(fpgapll_locked), .resetn_in(stream_rxen_fx3clk),
    .rstn_pulse_out(stream_rxen_fx3clk_pulse));
  or inst23 (spi_lms_miso, FPGA_SPI0_MISO, fpga_internal_spi);
  nios_cpu inst42 (
    .clk100(FX3_PCLK), .exfifo_if_d(exfifo_if_d), .exfifo_if_rdempty(exfifo_if_rdempty),
    .exfifo_of_wrfull(exfifo_of_wrfull), .spi_lms_MISO(spi_lms_miso), .switch({8{1'b0}}),
    .exfifo_if_rd(exfifo_if_rd), .exfifo_of_d(exfifo_of_d), .exfifo_of_wr(exfifo_of_wr),
    .exfifo_rst(exfifo_rst), .leds(nios_leds), .lms_ctr_gpio(lms_ctr_gpio),
    .spi_lms_MOSI(spi_lms_external_MOSI), .spi_lms_SCLK(spi_lms_external_SCLK), .spi_lms_SS_n(spi_enables),
    .spi_1_MOSI(FPGA_SPI1_MOSI), .spi_1_SCLK(FPGA_SPI1_SCLK),
    .spi_1_SS_n({FPGA_SPI1_ADF_SS, spi_1_enables[0]}), .i2c_scl(FPGA_I2C_SCL), .i2c_sda(FPGA_I2C_SDA));
  BUSMUX #(.WIDTH(3)) inst34 (
    .datab(3'b101), .sel(1'b0), .dataa({spi_enables[0], spi_lms_external_SCLK, spi_lms_external_MOSI}),
    .result({FPGA_SPI0_LMS_SS, FPGA_SPI0_SCLK, FPGA_SPI0_MOSI}));
  not inst8 (fpga_reset_n, EXT_GND);
  assign clk_fpga2 = SI_CLK0;  // WIRE inst31
  fpgacfg inst24 (
    .maddress({10{1'b0}}), .mimo_en(1'b1), .sdin(spi_lms_external_MOSI), .sclk(spi_lms_external_SCLK),
    .sen(spi_enables[1]), .lreset(fpga_reset_n), .mreset(fpga_reset_n), .HW_VER(HW_VER), .BOM_VER(BOM_VER),
    .PWR_SRC(PWR_SRC), .sdout(internal_spi_miso), .phase_reg_sel(phase_reg_sel), .clk_ind(clk_ind),
    .load_phase_reg(load_phase_reg), .drct_clk_en(drc_clk_en), .ch_en(lte_ch_en),
    .smpl_width(lte_smpl_width), .mode(lml_mode), .ddr_en(lml_ddr_en), .trxiq_pulse(lml_trxiq_pulse),
    .mimo_int_en(lte_mimo_en), .synch_dis(lte_synch_dis), .synch_mode(sync_mode),
    .smpl_nr_clr(lte_clr_smpl_nr), .txpct_loss_clr(lte_txpct_loss_clr), .rx_en(stream_rxen),
    .tx_en(stream_txen), .rx_ptrn_en(rx_ptrn_en), .tx_ptrn_en(tx_ptrn_en), .tx_cnt_en(tx_cnt_en),
    .wfm_ch_en(wfm_ch_en), .wfm_play(wfm_play), .wfm_load(wfm_load), .wfm_smpl_width(wfm_smpl_width),
    .SPI_SS(SPI_SS), .LMS1_SS(ctr_LMS_SPI_CS), .LMS1_RESET(lms1_reset), .LMS1_CORE_LDO_EN(LMS_CORE_LDO_EN),
    .LMS1_TXNRX1(LMS_TXNRX1), .LMS1_TXNRX2(LMS_TXNRX2), .LMS1_TXEN(LMS_TXEN), .LMS1_RXEN(LMS_RXEN),
    .GPIO({TX2_2_LB_SH, TX2_2_LB_AT, TX2_2_LB_H, GPIO[3], TX1_2_LB_SH, TX1_2_LB_AT, TX1_2_LB_H}),
    .FPGA_LED1_CTRL(FPGA_LED1_CTRL), .FPGA_LED2_CTRL(FPGA_LED2_CTRL), .FX3_LED_CTRL(FX3_LED_CTRL),
    .FCLK_ENA(FCLK_ENA), .sync_pulse_period(pulsesync_period), .sync_size(sync_size), .txant_pre(txant_pre),
    .txant_post(txant_post), .chirp_sync_en(chirp_sync_enable));  // open: oen, stateo, cnt_ind
  periphcfg inst17 (
    .maddress(10'b0000000110), .mimo_en(1'b1), .sdin(spi_lms_external_MOSI), .sclk(spi_lms_external_SCLK),
    .sen(spi_enables[1]), .lreset(fpga_reset_n), .mreset(fpga_reset_n),
    .BOARD_GPIO_RD({{8{1'b0}}, BOARD_GPIO_RD}), .PERIPH_INPUT_RD_0({{15{1'b0}}, LM75_OS}),
    .PERIPH_INPUT_RD_1({16{1'b0}}), .sdout(periphcfg_sdout), .BOARD_GPIO_OVRD(BOARD_GPIO_OVRD),
    .BOARD_GPIO_DIR(BOARD_GPIO_DIR), .BOARD_GPIO_VAL(BOARD_GPIO_VAL),
    .PERIPH_OUTPUT_OVRD_0(PERIPH_OUTPUT_OVRD_0), .PERIPH_OUTPUT_VAL_0(PERIPH_OUTPUT_VAL_0));  // open: oen, stateo, PERIPH_OUTPUT_OVRD_1, PERIPH_OUTPUT_VAL_1
  not inst44 (inst44_out, exfifo_rst);
  BUSMUX #(.WIDTH(1)) inst38 (
    .datab(PERIPH_OUTPUT_VAL_0[0]), .sel(PERIPH_OUTPUT_OVRD_0[0]), .dataa(LM75_OS), .result(FAN_CTRL));
  clock_test inst30 (
    .FX3_clk(FX3_PCLK), .reset_n(fpga_reset_n), .test_en(test_en[3:0]),
    .test_frc_err(test_inject_error[3:0]), .Si5351C_clk_0(SI_CLK0), .Si5351C_clk_1(SI_CLK1),
    .Si5351C_clk_2(SI_CLK2), .Si5351C_clk_3(SI_CLK3), .Si5351C_clk_5(SI_CLK5), .Si5351C_clk_6(SI_CLK6),
    .Si5351C_clk_7(SI_CLK7), .LMK_CLK(LMK_CLK), .ADF_MUXOUT(ADF_MUXOUT), .test_cmplt(clk_test_cmplt),
    .test_rez(clk_test_rez), .FX3_clk_cnt(inst30_fx3_clk_cnt), .Si5351C_clk_0_cnt(inst30_si5351c_clk_0_cnt),
    .Si5351C_clk_1_cnt(inst30_si5351c_clk_1_cnt), .Si5351C_clk_2_cnt(inst30_si5351c_clk_2_cnt),
    .Si5351C_clk_3_cnt(inst30_si5351c_clk_3_cnt), .Si5351C_clk_5_cnt(inst30_si5351c_clk_5_cnt),
    .Si5351C_clk_6_cnt(inst30_si5351c_clk_6_cnt), .Si5351C_clk_7_cnt(inst30_si5351c_clk_7_cnt),
    .LMK_CLK_cnt(inst30_lmk_clk_cnt), .ADF_MUXOUT_cnt(inst30_adf_muxout_cnt));
  FX3_slaveFIFO5b_top #(.dev_family("Cyclone IV E"), .data_width(32), .EP01_rwidth(64), .EP81_wrusedw_width(12), .EP81_wwidth(64), .EP0F_rwidth(32), .EP8F_wwidth(32)) inst41 (
    .reset_n(fpga_reset_n), .clk(FX3_PCLK), .usb_speed(1'b1), .flaga(FX3_CTL4), .flagb(FX3_CTL5),
    .ext_buff_rdy(stream_sw_rdy), .EP81_wclk(MCLK2RX_pll_d), .EP81_aclrn(stream_rxen_mclk2rxpll),
    .EP81_wr(rxpct_outfifowr), .EP81_wdata(rx_pct_data), .EP0F_rdclk(FX3_PCLK), .EP0F_rd(exfifo_if_rd),
    .EP8F_wclk(FX3_PCLK), .EP8F_aclrn(inst44_out), .EP8F_wr(exfifo_of_wr), .EP8F_wdata(exfifo_of_d),
    .slcs(FX3_CTL0), .faddr({fadr, FX3_CTL11, FX3_CTL12}), .slrd(FX3_CTL3), .sloe(FX3_CTL2), .slwr(FX3_CTL1),
    .pktend(FX3_CTL7), .ext_buff_data(\EP01_data[fx3_bus_width-1..0] ), .ext_buff_wr(EP01_data_valid),
    .EP81_wfull(fx3_outfifo_wfull), .EP81_wrusedw(\fx3_outfifo_wrusedw[fx3_outfifo_wrsize-1..0] ),
    .EP0F_rdata(exfifo_if_d), .EP0F_rempty(exfifo_if_rdempty), .EP8F_wfull(exfifo_of_wrfull),
    .GPIF_busy(FX3_slave_busy), .fdata(FX3_DQ));  // open: flagc, flagd, EP01_rdclk, EP01_rd, clk_out, EPSWITCH, EP01_rdata, EP01_rempty
  or inst47 (inst47_out, FX3_slave_busy, nios_leds[0], FX3_CTL8);
  not inst19 (TX1_2_LB_L, TX1_2_LB_H);
  not inst21 (inst21_out, FX3_busy);
  gpio_ctrl_top #(.bus_width(8)) inst2 (
    .mux_sel(BOARD_GPIO_OVRD[7:0]), .dir_0({8{1'b1}}), .dir_1(BOARD_GPIO_DIR[7:0]),
    .out_val_0({1'b0, chirp_sync_enable, chirp_len[1], TESTOUT, chirp_sync_trig, rxpct_outfifowr, MCLK2RX_pll_d, LMS_DIQ2_IQSEL2}),
    .out_val_1(BOARD_GPIO_VAL[7:0]), .gpio_in(BOARD_GPIO_RD), .gpio(FPGA_GPIO));
  stream_switch #(.data_width(fx3_bus_width), .wfm_fifo_wrusedw_size(12), .wfm_limit(4096)) inst (
    .clk(FX3_PCLK), .reset_n(fpga_reset_n), .data_in(\EP01_data[fx3_bus_width-1..0] ),
    .data_in_valid(EP01_data_valid), .dest_sel(wfm_load), .tx_fifo_rdy(tx_outfifo_rdy),
    .wfm_rdy(wfm_player_rdy), .wfm_fifo_wrusedw(wfm_player_wrusedw), .data_in_rdy(stream_sw_rdy),
    .tx_fifo_wr(tx_outfifo_wrreq), .tx_fifo_data(tx_outfifo_data), .wfm_fifo_wr(wfm_wr), .wfm_data(wfm_data));
  FPGA_LED1_cntrl inst3 (
    .pll1_locked(mclk1tx_locked), .pll2_locked(rxpll_locked), .alive(fpga_alive), .led_ctrl(FPGA_LED1_CTRL),
    .led_g(FPGA_LED1_G), .led_r(FPGA_LED1_R));
  FPGA_LED2_ctrl inst15 (
    .clk(FPGA_SPI1_SCLK), .reset_n(fpga_reset_n), .adf_muxout(ADF_MUXOUT), .dac_ss(spi_1_enables[0]),
    .adf_ss(FPGA_SPI1_ADF_SS), .led_ctrl(FPGA_LED2_CTRL), .led_g(FPGA_LED2_G), .led_r(FPGA_LED2_R));
  FX3_LED_ctrl inst22 (
    .ctrl_led_g(inst21_out), .ctrl_led_r(FX3_busy), .HW_VER(HW_VER), .led_ctrl(FX3_LED_CTRL),
    .led_g(FX3_LED_G), .led_r(FX3_LED_R));
  busy_delay #(.clock_period(10), .delay_time(200)) inst11 (
    .clk(FX3_PCLK), .reset_n(fpga_reset_n), .busy_in(inst47_out), .busy_out(FX3_busy));
  alive inst4 (.rst(fpga_reset_n), .clk(clk_fpga2), .beat(fpga_alive));
  miso_mux inst18 (
    .fpga_miso(mux_spi_miso), .ext_miso(1'b0), .fpga_cs(BRDG_SPI_FPGA_SS), .ext_cs(ctr_LMS_SPI_CS),
    .out_miso(BRDG_SPI_MISO));
  and inst13 (LMS_RESET, lms1_reset, lms_ctr_gpio[0]);
  tstcfg inst39 (
    .maddress(10'b0000000011), .mimo_en(1'b1), .sdin(spi_lms_external_MOSI), .sclk(spi_lms_external_SCLK),
    .sen(spi_enables[1]), .lreset(fpga_reset_n), .mreset(fpga_reset_n),
    .TEST_CMPLT({ddr2_2_test_complete, ddr2_1_test_complete, clk_test_cmplt}),
    .TEST_REZ({ddr2_2_test_pass, ddr2_1_test_pass, clk_test_rez}), .FX3_CLK_CNT(inst30_fx3_clk_cnt),
    .Si5351C_CLK0_CNT(inst30_si5351c_clk_0_cnt), .Si5351C_CLK1_CNT(inst30_si5351c_clk_1_cnt),
    .Si5351C_CLK2_CNT(inst30_si5351c_clk_2_cnt), .Si5351C_CLK3_CNT(inst30_si5351c_clk_3_cnt),
    .Si5351C_CLK5_CNT(inst30_si5351c_clk_5_cnt), .Si5351C_CLK6_CNT(inst30_si5351c_clk_6_cnt),
    .Si5351C_CLK7_CNT(inst30_si5351c_clk_7_cnt), .LMK_CLK_CNT(inst30_lmk_clk_cnt),
    .ADF_CNT(inst30_adf_muxout_cnt),
    .DDR2_1_STATUS({ddr2_1_test_fail, ddr2_1_test_pass, ddr2_1_test_complete}),
    .DDR2_1_pnf_per_bit(ddr2_1_pnf_per_bit_persisit),
    .DDR2_2_STATUS({ddr2_2_test_fail, ddr2_2_test_pass, ddr2_2_test_complete}),
    .DDR2_2_pnf_per_bit(ddr2_2_pnf_per_bit_persisit), .sdout(tstcfg_sdout), .TEST_EN(test_en),
    .TEST_FRC_ERR(test_inject_error), .TX_TST_I(TX_TST_I), .TX_TST_Q(TX_TST_Q));  // open: oen, stateo
  or inst40 (mux_spi_miso, 1'b0, pllcfg_sdoutA, tstcfg_sdout);
  OPNDRN inst16 (.IN(spi_1_enables[0]), .OUT(FPGA_SPI1_DAC_SS));
  not inst25 (TX2_2_LB_L, TX2_2_LB_H);
  and inst51 (inst51_out, stream_rxen_fx3clk, chirp_sync_enable);
  not inst45 (fpgapll_locked, EXT_GND);
  not inst64 (inst64_out, pllrst_start[1]);
  rx_synchronizers inst20 (
    .clk1(MCLK2RX_pll_d), .clk1_reset_n(rxpll_locked), .clk1_d0(stream_rxen_fx3clk), .clk1_d1(lte_mimo_en),
    .clk1_s0(stream_rxen_mclk2rxpll), .clk1_s1(lte_mimo_en_mclk2rxpll));
  wfm_player_top #(.dev_family("Cyclone IV E"), .cntrl_rate(1), .cntrl_bus_size(16), .addr_size(25), .lcl_bus_size(63), .lcl_burst_length(2), .cmd_fifo_size(9), .wfm_infifo_size(12), .wfm_outfifo_size(11), .data_width(32), .iq_width(12), .dcmpr_fifo_size(10)) inst27 (
    .reset_n(fpga_reset_n), .ddr2_pll_ref_clk(clk_fpga2), .wcmd_clk(FX3_PCLK), .rcmd_clk(ddr2_1_phy_clk),
    .wfm_load(wfm_load), .wfm_play_stop(wfm_play), .wfm_data(wfm_data), .wfm_wr(wfm_wr),
    .sample_width(wfm_smpl_width), .fr_start(1'b0), .ch_en(wfm_ch_en[1:0]), .mimo_en(1'b1), .iq_clk(lmlclk),
    .begin_test(test_en[4]), .insert_error(test_inject_error[4]), .wfm_rdy(wfm_player_rdy),
    .wfm_infifo_wrusedw(wfm_player_wrusedw), .dd_iq_h(dd_iq_h), .dd_iq_l(dd_iq_l), .mem_odt(DDR2_1_odt[0]),
    .mem_cs_n(DDR2_1_cs_n[0]), .mem_cke(DDR2_1_cke[0]), .mem_addr(DDR2_1_addr), .mem_ba(DDR2_1_ba),
    .mem_ras_n(DDR2_1_ras_n), .mem_cas_n(DDR2_1_cas_n), .mem_we_n(DDR2_1_we_n), .mem_dm(DDR2_1_dm),
    .phy_clk(ddr2_1_phy_clk), .pnf_per_bit_persist(ddr2_1_pnf_per_bit_persisit), .pass(ddr2_1_test_pass),
    .fail(ddr2_1_test_fail), .test_complete(ddr2_1_test_complete), .mem_clk(DDR2_1_clk[0]),
    .mem_clk_n(DDR2_1_clk_n[0]), .mem_dq(DDR2_1_dq), .mem_dqs(DDR2_1_dqs));  // open: pnf_per_bit
  ddr2_tester inst46 (
    .global_reset_n(test_en[5]), .pll_ref_clk(SI_CLK1), .soft_reset_n(test_en[5]),
    .insert_error(test_inject_error[5]), .mem_odt(DDR2_2_odt[0]), .mem_cs_n(DDR2_2_cs_n[0]),
    .mem_cke(DDR2_2_cke[0]), .mem_addr(DDR2_2_addr), .mem_ba(DDR2_2_ba), .mem_ras_n(DDR2_2_ras_n),
    .mem_cas_n(DDR2_2_cas_n), .mem_we_n(DDR2_2_we_n), .mem_dm(DDR2_2_dm),
    .pnf_per_bit_persist(ddr2_2_pnf_per_bit_persisit), .pass(ddr2_2_test_pass), .fail(ddr2_2_test_fail),
    .test_complete(ddr2_2_test_complete), .mem_clk(DDR2_2_clk[0]), .mem_clk_n(DDR2_2_clk_n[0]),
    .mem_dq(DDR2_2_dq), .mem_dqs(DDR2_2_dqs));  // open: begin_test, pnf_per_bit
  rx_pll_top #(.bandwidth_type("AUTO"), .clk0_divide_by(1), .clk0_duty_cycle(50), .clk0_multiply_by(1), .clk0_phase_shift("0"), .clk1_divide_by(1), .clk1_duty_cycle(50), .clk1_multiply_by(1), .clk1_phase_shift("0"), .compensate_clock("CLK1"), .inclk0_input_frequency(6250), .intended_device_family("Cyclone IV E"), .operation_mode("SOURCE_SYNCHRONOUS"), .scan_chain_mif_file("ip/pll/pll.mif"), .drct_c0_ndly(1), .drct_c1_ndly(2)) inst48 (
    .pll_inclk(LMS_MCLK2), .pll_areset(pllrst_start[1]), .pll_logic_reset_n(fpga_reset_n), .inv_c0(1'b0),
    .clk_ena(2'b11), .drct_clk_en({2{drc_clk_en[1]}}), .rcnfg_clk(LMK_CLK), .rcnfig_areset(pllrst_start[1]),
    .rcnfig_en(pllcfg_start[1]), .rcnfig_data(pllcfg_data), .dynps_mode(pllcfg_phcfg_mode),
    .dynps_areset_n(inst64_out), .dynps_en(phcfg_start[1]), .dynps_tst(pllcfg_phcfg_tst),
    .dynps_dir(phcfg_updn), .dynps_cnt_sel(cnt_ind[2:0]), .dynps_phase(cnt_phase[9:0]),
    .dynps_step_size(pllcfg_auto_phcfg_step[9:0]), .smpl_cmp_done(rx_path_smpl_cmp_done),
    .smpl_cmp_error(rx_path_smpl_cmp_err), .c0(LMS_FCLK2), .c1(MCLK2RX_pll_d), .pll_locked(rxpll_locked),
    .rcnfig_status(rx_reconfig_status), .dynps_done(rxpll_dynps_done), .dynps_status(rxpll_dynps_status),
    .smpl_cmp_en(rxpll_smpcmp_en), .busy(rxpllcfg_busy));  // open: dynps_busy
  gpio_chirp_sync_top #(.chirp_sync_width(64)) inst56 (
    .clk(MCLK2RX_pll_d), .counter_clk(MCLK2RX_pll_d), .reset_n(inst51_out), .chirp_sig(BOARD_GPIO_RD[7]),
    .sample_width(lte_smpl_width), .mode(lml_mode), .trxiqpulse(lml_trxiq_pulse), .ddr_en(lml_ddr_en),
    .mimo_en(lte_mimo_en), .ch_en(lte_ch_en[1:0]), .chirp_sync_en(chirp_sync_enable),
    .sync_period(chirp_len), .chirp_trig(chirp_sync_trig), .TESTOUT(TESTOUT));
  pulse_gen #(.wait_cycles(6250)) inst33 (
    .clk(lmlclk), .reset_n(stream_rxen_fx3clk), .wait_cycles(pulsesync_period), .pulse(pct_sync_pulse));
  or inst49 (inst49_out, rxpll_smpcmp_en, txpll_smpcmp_en);
  pllcfg_top #(.n_pll(2)) inst9 (
    .sdinA(spi_lms_external_MOSI), .sclkA(spi_lms_external_SCLK), .senA(spi_enables[1]),
    .lreset(fpga_reset_n), .mreset(fpga_reset_n), .pllcfg_busy({1'b0, pllcfg_busy}),
    .pllcfg_done({1'b1, pllcfg_done}), .pll_lock({rxpll_locked, mclk1tx_locked}),
    .auto_phcfg_done({rxpll_dynps_done, txpll_dynps_done}),
    .auto_phcfg_err({rxpll_dynps_status, txpll_dynps_status}), .sdoutA(pllcfg_sdoutA), .oenA(pllcfg_oenA),
    .phcfg_mode(pllcfg_phcfg_mode), .phcfg_tst(pllcfg_phcfg_tst), .phcfg_start(phcfg_start),
    .pllcfg_start(pllcfg_start), .pllrst_start(pllrst_start), .phcfg_updn(phcfg_updn), .cnt_ind(cnt_ind),
    .cnt_phase(cnt_phase), .pllcfg_data(pllcfg_data), .auto_phcfg_smpls(pllcfg_auto_phcfg_smpls),
    .auto_phcfg_step(pllcfg_auto_phcfg_step));  // open: sdinB, sclkB, senB, sdoutB, oenB
  or inst12 (pllcfg_busy, rxpllcfg_busy, txpllcfg_busy);
  tx_path_top #(.dev_family("Cyclone IV E"), .iq_width(12), .pct_size_w(16), .n_buff(4), .in_pct_data_w(128), .out_pct_data_w(64), .decomp_fifo_size(9)) inst28 (
    .pct_wrclk(FX3_PCLK), .iq_rdclk(lmlclk), .reset_n(stream_rxen_fx3clk), .en(stream_rxen_fx3clk),
    .rx_sample_clk(MCLK2RX_pll_d), .rx_sample_nr(rx_path_sampl_nr), .pct_sync_mode(sync_mode),
    .pct_sync_dis(lte_synch_dis), .pct_sync_pulse(pct_sync_pulse), .pct_sync_size(sync_size),
    .pct_loss_flg_clr(lte_txpct_loss_clr), .txant_cyc_before_en(txant_pre), .txant_cyc_after_en(txant_post),
    .mode(lml_mode), .trxiqpulse(lml_trxiq_pulse), .ddr_en(lml_ddr_en), .mimo_en(lte_mimo_en),
    .ch_en(lte_ch_en[1:0]), .fidm(1'b0), .sample_width(lte_smpl_width), .in_pct_wrreq(tx_outfifo_wrreq),
    .in_pct_data(tx_outfifo_data), .chirp_sync_en(chirp_sync_enable), .pct_loss_flg(pct_buff_aclr),
    .txant_en(tx_path_tx_ant_en), .DIQ_h(tx_path_h), .DIQ_l(tx_path_l), .in_pct_full(inst28_in_pct_full));  // open: DIQ, fsync
  rx_path_top #(.dev_family("Cyclone IV E"), .iq_width(12), .invert_input_clocks("ON"), .smpl_buff_rdusedw_w(11), .pct_buff_wrusedw_w(12)) inst53 (
    .clk(MCLK2RX_pll_d), .reset_n(stream_rxen_fx3clk), .test_ptrn_en(rx_ptrn_en),
    .sample_width(lte_smpl_width), .mode(lml_mode), .trxiqpulse(lml_trxiq_pulse), .ddr_en(lml_ddr_en),
    .mimo_en(lte_mimo_en), .ch_en(lte_ch_en[1:0]), .fidm(1'b0), .chirp_sync_en(chirp_sync_enable),
    .DIQ(LMS_DIQ2_D), .fsync(LMS_DIQ2_IQSEL2),
    .pct_fifo_wusedw({12{\fx3_outfifo_wrusedw[fx3_outfifo_wrsize-1..0] }}), .clr_smpl_nr(lte_clr_smpl_nr),
    .ld_smpl_nr(1'b0), .smpl_nr_in({64{1'b0}}), .tx_pct_loss(pct_buff_aclr),
    .tx_pct_loss_clr(lte_txpct_loss_clr), .smpl_cmp_start(inst49_out),
    .smpl_cmp_length(pllcfg_auto_phcfg_smpls), .chirp_sync_length(chirp_len),
    .chirp_sync_trig(chirp_sync_trig), .smpl_fifo_wrreq_out(rx_smpl_pct_fifo_wrreq_out),
    .pct_fifo_wrreq(rxpct_outfifowr), .pct_fifo_wdata(rx_pct_data), .smpl_nr_cnt(rx_path_sampl_nr),
    .smpl_cmp_done(rx_path_smpl_cmp_done), .smpl_cmp_err(rx_path_smpl_cmp_err),
    .bit_pack_valid(bit_pack_valid), .smpl_buff_rdreq(smpl_buff_rdreg));
  not inst14 (pllcfg_done, pllcfg_busy);
  not inst36 (tx_outfifo_rdy, inst28_in_pct_full);
  not inst66 (inst66_out, pllrst_start[0]);
  tx_pll_top #(.bandwidth_type("AUTO"), .clk0_divide_by(1), .clk0_duty_cycle(50), .clk0_multiply_by(1), .clk0_phase_shift("0"), .clk1_divide_by(1), .clk1_duty_cycle(50), .clk1_multiply_by(1), .clk1_phase_shift("0"), .compensate_clock("CLK1"), .inclk0_input_frequency(6250), .intended_device_family("Cyclone IV E"), .operation_mode("SOURCE_SYNCHRONOUS"), .scan_chain_mif_file("ip/txpll/txpll.mif"), .drct_c0_ndly(1), .drct_c1_ndly(2)) inst32 (
    .pll_inclk(LMS_MCLK1), .pll_areset(pllrst_start[0]), .pll_logic_reset_n(fpga_reset_n), .inv_c0(1'b0),
    .clk_ena(2'b11), .drct_clk_en({2{drc_clk_en[0]}}), .rcnfg_clk(LMK_CLK), .rcnfig_areset(pllrst_start[0]),
    .rcnfig_en(pllcfg_start[0]), .rcnfig_data(pllcfg_data), .dynps_areset_n(inst66_out),
    .dynps_mode(pllcfg_phcfg_mode), .dynps_en(phcfg_start[0]), .dynps_tst(pllcfg_phcfg_tst),
    .dynps_dir(phcfg_updn), .dynps_cnt_sel(cnt_ind[2:0]), .dynps_phase(cnt_phase[9:0]),
    .dynps_step_size(pllcfg_auto_phcfg_step[9:0]), .smpl_cmp_done(rx_path_smpl_cmp_done),
    .smpl_cmp_error(rx_path_smpl_cmp_err), .c0(LMS_FCLK1), .c1(lmlclk), .pll_locked(mclk1tx_locked),
    .rcnfig_status(tx_reconfig_status), .dynps_done(txpll_dynps_done), .dynps_status(txpll_dynps_status),
    .smpl_cmp_en(txpll_smpcmp_en), .busy(txpllcfg_busy));  // open: dynps_busy
  lms7002_ddout #(.dev_family(dev_family), .iq_width(12)) inst7 (
    .clk(lmlclk), .reset_n(mclk1tx_locked), .data_in_h(ddmux_h), .data_in_l(ddmux_l), .txiq(LMS_DIQ1_D),
    .txiqsel(LMS_DIQ1_IQSEL));
  txiqmux #(.diq_width(12)) inst10 (
    .clk(lmlclk), .reset_n(mclk1tx_locked), .test_ptrn_en(tx_ptrn_en), .test_ptrn_fidm(1'b0),
    .test_ptrn_I(TX_TST_I), .test_ptrn_Q(TX_TST_Q), .test_data_en(tx_cnt_en), .test_data_mimo_en(1'b1),
    .mux_sel(wfm_play), .tx_diq_h(tx_path_h), .tx_diq_l(tx_path_l), .wfm_diq_h(dd_iq_h[12:0]),
    .wfm_diq_l(dd_iq_l[12:0]), .diq_h(ddmux_h), .diq_l(ddmux_l));

  // Other names for the same wires on the sheet: fadr[1:0] = {FX3_CTL11, FX3_CTL12}; fclk1 = LMS_FCLK1;
  //   flag_a = FX3_CTL4; flag_b = FX3_CTL5; fpga_reset = EXT_GND; FSYNC = LMS_DIQ2_IQSEL2; fx3_clk = FX3_PCLK;
  //   FX3_MCU_BUSY = FX3_CTL8;
  //   GPIO (some bits) = {TX2_2_LB_SH, TX2_2_LB_AT, TX2_2_LB_H, TX1_2_LB_SH, TX1_2_LB_AT, TX1_2_LB_H};
  //   txiq[11:0] = LMS_DIQ1_D; txiqsel = LMS_DIQ1_IQSEL; MCLK1TX = LMS_MCLK1; MCLK2RX = LMS_MCLK2;
  //   MCLK2RX_pll = LMS_FCLK2; mux_fpga_spi0_lms_ss = FPGA_SPI0_LMS_SS; mux_fpga_spi0_mosi = FPGA_SPI0_MOSI;
  //   mux_fpga_spi0_sclk = FPGA_SPI0_SCLK; pkt_end = FX3_CTL7; SLOE = FX3_CTL2; SLRD = FX3_CTL3; SLWR = FX3_CTL1;
  //   spi_1_enables[1] = FPGA_SPI1_ADF_SS

  // Notes on the sheet:
  //   General I/O, clock pins, ect
  //   PLL`s and pll control
  //   fx3_clk
  //   Stream out buffer
  //   Board SPI
  //   For v1.1 board compatibility. 
  //   v1.1 board has GND connected to J3, to avoid shorting output directly to ground 
  //   Open-drain output with weak pull up implemented
  //   NIOS CPU
  //   FX3 slaveFIFo interface
  //   LML TX interface synchronization
  //   fx3_outfifo_wrsize=ceil(log2(desired fifo word count in wr side))+1
  //   fx3_outfifo_rdsize=ceil(log2(desired fifo word count in wr side*fx3_outfifo_wrwidth/fx3_bus_width))+1
  //   LMS GPIO
  //   WFM player
  //   FPGA registers
  //   DDR2_2 memory test logic
  //   DESCRIPTION
  //   BOARD
  //   LimeSDR-USB
  //   DATE
  //   2016-09-27
  //   AUTHOR
  //   Lime Microsystems
endmodule
